# EAGLE schematic pdp8l (EAGLE 6.6.0), part 1 of 2

## Sheet 1 of 23
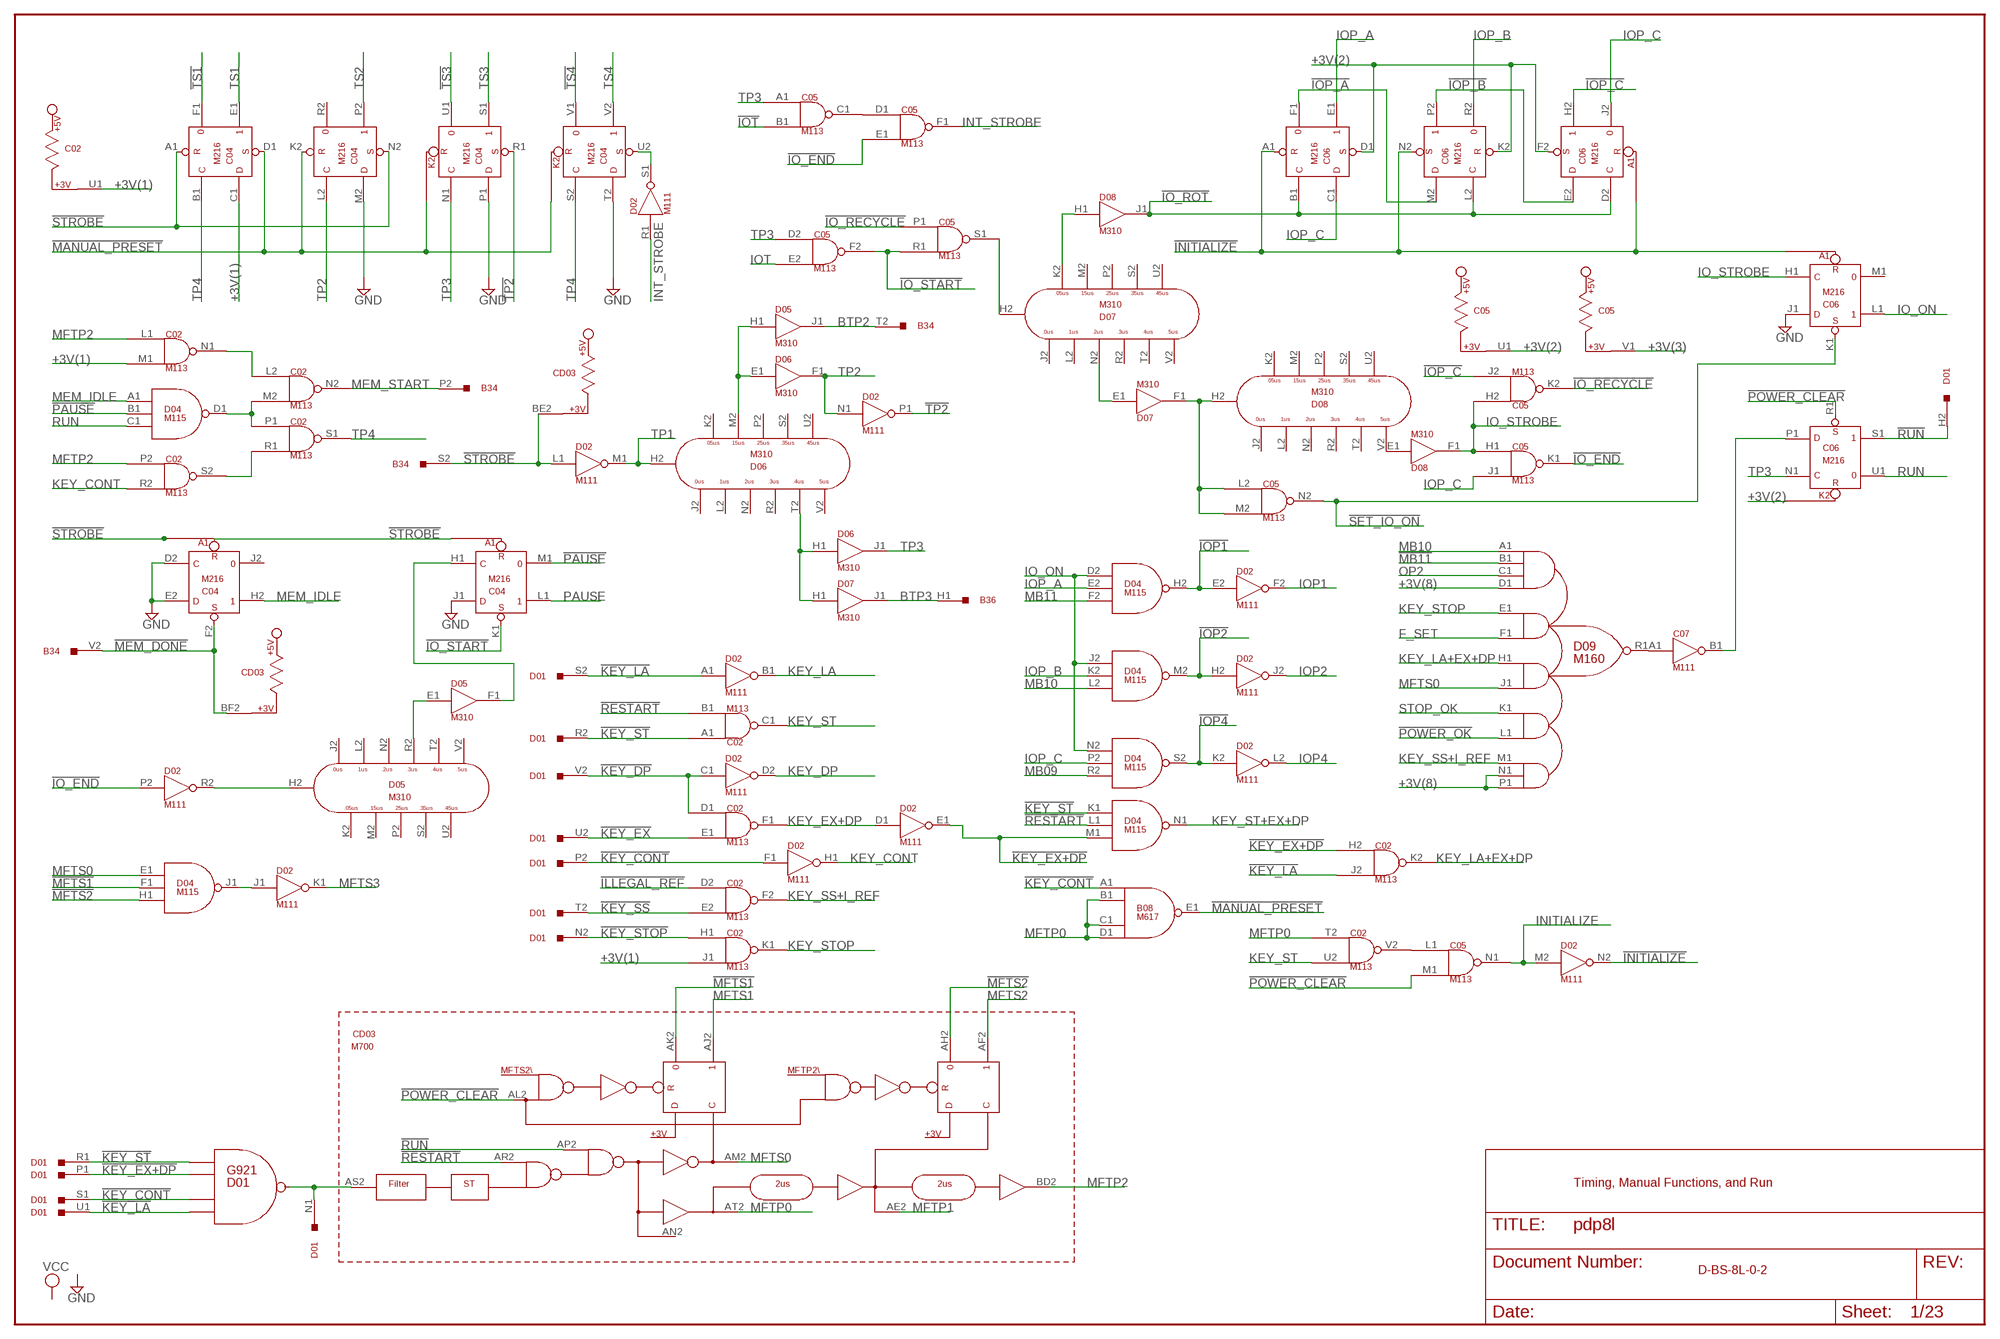
[diagram p0: schematic, sheet 1]

### Parts
B08  M617  [H807]
B34  M903  [H807]
B36  M903  [H807]
C02  M113  [H807]
C04  M216  M206X  [H807]
C05  M113  [H807]
C06  M216  M206X  [H807]
C07  M111  [H807]
CD03  M700  [H807-2]
D01  G921  M916  [H807]
D02  M111  [H807]
D04  M115  [H807]
D05  M310  [H807]
D06  M310  [H807]
D07  M310  [H807]
D08  M310  [H807]
D09  M160  [H807]

### Nets
!ILLEGAL_REF: C02.D2(F2:IN1) ; also sheet 2,5
!INITIALIZE: C06.A1(E1:R) C06.N2(P2:S) D02.N2(N2:OUT) ; also sheet 12,21,22
!INT_STROBE: C04.U2(V2:S) D02.S1(S1:OUT)
!IO_END: C05.E1(F1:IN2) C05.K1(K1:OUT) D02.P2(R2:IN)
!IO_RECYCLE: C05.K2(K2:OUT) C05.P1(S1:IN1)
!IO_ROT: C06.B1(E1:C) C06.D2(H2:C) C06.L2(P2:C) D08.J1(J1:OUT)
!IO_START: C04.K1(L1:S) C05.F2(F2:OUT) C05.R1(S1:IN2)
!IOP1: D02.E2(F2:IN) D04.H2(H2:OUT) ; also sheet 3,12
!IOP2: D02.H2(J2:IN) D04.M2(M2:OUT) ; also sheet 3,12
!IOP4: D02.K2(L2:IN) D04.S2(S2:OUT) ; also sheet 3,12
!IOP_A: C06.F1 C06.M2(P2:D)
!IOP_B: C06.E2(H2:D) C06.P2
!IOP_C: C05.J2(K2:IN2) C06.H2
!IOT: C05.B1(C1:IN2) ; also sheet 2
!KEY_CONT: B08.A1(E1:IN1) D01.P2 D01.S1 D02.F1(H1:IN) ; also sheet 5
!KEY_DP: C02.D1(F1:IN1) D01.V2 D02.C1(D2:IN)
!KEY_EX: C02.E1(F1:IN2) D01.U2
!KEY_EX+DP: C02.H2(K2:IN1) D01.P1 D02.E1(E1:OUT) D04.M1(N1:IN3)
!KEY_LA: C02.J2(K2:IN2) D01.S2 D01.U1 D02.A1(B1:IN) ; also sheet 19
!KEY_SS: C02.E2(F2:IN2) D01.T2
!KEY_ST: C02.A1(C1:IN1) D01.R1 D01.R2 D04.K1(N1:IN1)
!KEY_STOP: C02.H1(K1:IN1) D01.N2
!MANUAL_PRESET: B08.E1(E1:OUT) C04.D1(E1:S) C04.K2(P2:R) ; also sheet 2,6
!MB11: D09.B1(R1:IN1B) ; also sheet 2,3,6,7,16,23
!MEM_DONE: B34.V2 C04.F2(H2:S) CD03.BF2 ; also sheet 6,15
!MFTS1: CD03.AK2(CK2) D04.F1(J1:IN2) ; also sheet 3
!MFTS2: CD03.AH2(CH2) D04.H1(J1:IN3) ; also sheet 3
!MFTS3: D02.J1(K1:IN) D04.J1(J1:OUT)
!PAUSE: C04.M1 D04.B1(D1:IN2)
!POWER_CLEAR: C05.M1(N1:IN2) C06.R1(S1:S) CD03.AL2(CL2) ; also sheet 15
!POWER_OK: D09.L1(R1:IN4B) ; also sheet 15
!RESTART: C02.B1(C1:IN2) CD03.AR2(CR2) D04.L1(N1:IN2) ; also sheet 3,19,20
!RUN: C06.S1 CD03.AP2(CP2) D01.H2 ; also sheet 12
!SET_IO_ON: C05.N2(N2:OUT) C06.K1(L1:S) ; also sheet 5
!STROBE: B34.S2 C04.A1(E1:R) C04.N2(P2:S) CD03.BE2 D02.L1(M1:IN) ; also sheet 6,15
!TP2: C04.R1(S1:S) D02.P1(P1:OUT) ; also sheet 5
!TS1: C04.F1 ; also sheet 12
!TS3: C04.U1 ; also sheet 12
!TS4: C04.V1 ; also sheet 3
+3V(1): C02.J1(K1:IN2) C02.M1(N1:IN2) C02.U1 C04.C1(E1:D) ; also sheet 2
+3V(2): C05.U1 C06.D1(E1:S) C06.F2(H2:S) C06.K2(P2:R)
+3V(3): C05.V1 ; also sheet 2
+3V(8): D09.D1(R1:IN1D) D09.N1(R1:IN5B) D09.P1(R1:IN5C) ; also sheet 3
BTP2: B34.T2 D05.J1(J1:OUT)
BTP3: B36.H1 D07.J1(J1:OUT)
C02N1: C02.L2(N2:IN1) C02.N1(N1:OUT)
C02S2: C02.R1(S1:IN2) C02.S2(S2:OUT)
C02V2: C02.V2(V2:OUT) C05.L1(N1:IN1)
C05C1: C05.C1(C1:OUT) C05.D1(F1:IN1)
C05S1: C05.S1(S1:OUT) D07.H2(H2:H2)
C07B1: C06.P1(S1:D) C07.B1(B1:OUT)
D01N1: CD03.AS2(CS2) D01.N1
D04D1: C02.M2(N2:IN2) C02.P1(S1:IN1) D04.D1(D1:OUT)
D05F1: C04.H1(L1:C) D05.F1(F1:OUT)
D05R2: D05.E1(F1:IN) D05.R2(H2:R2)
D06M2: D05.H1(J1:IN) D06.E1(F1:IN) D06.M2(H2:M2)
D06T2: D06.H1(J1:IN) D06.T2(H2:T2) D07.H1(J1:IN)
D07K2: D07.K2(H2:K2) D08.H1(J1:IN)
D07N2: D07.E1(F1:IN) D07.N2(H2:N2)
D08V2: D08.E1(F1:IN) D08.V2(H2:V2)
D09R1: C07.A1(B1:IN) D09.R1(R1:OUT)
F_SET: D09.F1(R1:IN2B) ; also sheet 2,3,6
GND [Supply]: C04.D2(H2:C) C04.E2(H2:D) C04.J1(L1:D) C04.M2(P2:D) C04.P1(S1:D) C04.T2(V2:D) C06.J1(L1:D) ; also sheet 3,8,9,10,11,12,13,14,15,16,19,20,21,23
INITIALIZE: C05.N1(N1:OUT) D02.M2(N2:IN) ; also sheet 12,13,14
INT_STROBE: C05.F1(F1:OUT) D02.R1(S1:IN) ; also sheet 6
IO_END: D02.R2(R2:OUT) D05.H2(H2:H2)
IO_ON: C06.L1 D04.D2(H2:IN1) D04.J2(M2:IN1) D04.N2(S2:IN1)
IO_STROBE: C05.H1(K1:IN1) C05.H2(K2:IN1) C06.H1(L1:C) D08.F1(F1:OUT) ; also sheet 5
IOP1: D02.F2(F2:OUT) ; also sheet 13,14,21,22,23
IOP2: D02.J2(J2:OUT) ; also sheet 13,14,20,21,22
IOP4: D02.L2(L2:OUT) ; also sheet 13,14,21,22,23
IOP_A: C06.E1 D04.E2(H2:IN2)
IOP_B: C06.R2 D04.K2(M2:IN2)
IOP_C: C05.J1(K1:IN2) C06.C1(E1:D) C06.J2 D04.P2(S2:IN2)
IOT: C05.E2(F2:IN2) ; also sheet 2,6
KEY_CONT: C02.R2(S2:IN2) D02.H1(H1:OUT)
KEY_DP: D02.D2(D2:OUT) ; also sheet 3
KEY_EX+DP: C02.F1(F1:OUT) D02.D1(E1:IN) ; also sheet 3,4
KEY_LA: D02.B1(B1:OUT) ; also sheet 3,19
KEY_LA+EX+DP: C02.K2(K2:OUT) D09.H1(R1:IN3A) ; also sheet 5
KEY_SS+I_REF: C02.F2(F2:OUT) D09.M1(R1:IN5A)
KEY_ST: C02.C1(C1:OUT) C02.U2(V2:IN2) ; also sheet 2,3
KEY_ST+EX+DP: D04.N1(N1:OUT) ; also sheet 3
KEY_STOP: C02.K1(K1:OUT) D09.E1(R1:IN2A)
MB09: D04.R2(S2:IN3) ; also sheet 3,4,7,12,23
MB10: D04.L2(M2:IN3) D09.A1(R1:IN1A) ; also sheet 4,7,12,23
MB11: D04.F2(H2:IN3) ; also sheet 4,7,12,23
MEM_IDLE: C04.H2 D04.A1(D1:IN1)
MEM_START: B34.P2 C02.N2(N2:OUT) ; also sheet 15
MFTP0: B08.B1(E1:IN2) B08.C1(E1:IN3) B08.D1(E1:IN4) C02.T2(V2:IN1) CD03.AT2(CT2) ; also sheet 19
MFTP1: CD03.AE2(CE2) ; also sheet 5,19
MFTP2: C02.L1(N1:IN1) C02.P2(S2:IN1) CD03.BD2(DD2) ; also sheet 2,5
MFTS0: CD03.AM2(CM2) D04.E1(J1:IN1) D09.J1(R1:IN3B)
MFTS1: CD03.AJ2(CJ2) ; also sheet 3
MFTS2: CD03.AF2(CF2) ; also sheet 3,4
MFTS3: D02.K1(K1:OUT) ; also sheet 3
OP2: D09.C1(R1:IN1C) ; also sheet 2,3,5
PAUSE: C04.L1 ; also sheet 3
RUN: C06.U1 D04.C1(D1:IN3)
SET_IO_ON: C05.L2(N2:IN1) C05.M2(N2:IN2) D07.F1(F1:OUT) D08.H2(H2:H2)
STOP_OK: D09.K1(R1:IN4A) ; also sheet 15,20
TP1: D02.M1(M1:OUT) D06.H2(H2:H2) ; also sheet 2,5,6
TP2: C04.L2(P2:C) D02.N1(P1:IN) D06.F1(F1:OUT) ; also sheet 2,5,6
TP3: C04.N1(S1:C) C05.A1(C1:IN1) C05.D2(F2:IN1) C06.N1(S1:C) D06.J1(J1:OUT) ; also sheet 5,23
TP4: C02.S1(S1:OUT) C04.B1(E1:C) C04.S2(V2:C) ; also sheet 2,5,6
TS1: C04.E1 ; also sheet 3,4
TS2: C04.P2 ; also sheet 2,3,4,5
TS3: C04.S1 ; also sheet 2,3,4
TS4: C04.V2 ; also sheet 3,19
Unconnected: B34.M2 B36.K2 B36.M2 B36.P2 C02.V1 C04.J2 C04.R2 C06.M1 CD03.AN2(CN2) D01.A1 D01.B1 D01.B2 D01.K1 D01.L1 D01.M1 D05.J2(H2:J2) D05.K2(H2:K2) D05.L2(H2:L2) D05.M2(H2:M2) D05.N2(H2:N2) D05.P2(H2:P2) D05.S2(H2:S2) D05.T2(H2:T2) D05.U2(H2:U2) D05.V2(H2:V2) D06.J2(H2:J2) D06.K2(H2:K2) D06.L2(H2:L2) D06.N2(H2:N2) D06.P2(H2:P2) D06.R2(H2:R2) D06.S2(H2:S2) D06.U2(H2:U2) D06.V2(H2:V2) D07.J2(H2:J2) D07.L2(H2:L2) D07.M2(H2:M2) D07.P2(H2:P2) D07.R2(H2:R2) D07.S2(H2:S2) D07.T2(H2:T2) D07.U2(H2:U2) D07.V2(H2:V2) D08.J2(H2:J2) D08.K2(H2:K2) D08.L2(H2:L2) D08.M2(H2:M2) D08.N2(H2:N2) D08.P2(H2:P2) D08.R2(H2:R2) D08.S2(H2:S2) D08.T2(H2:T2) D08.U2(H2:U2)

### Notes on the sheet
- G921
- D01 | Timing, Manual Functions, and Run
- D-BS-8L-0-2

## Sheet 2 of 23
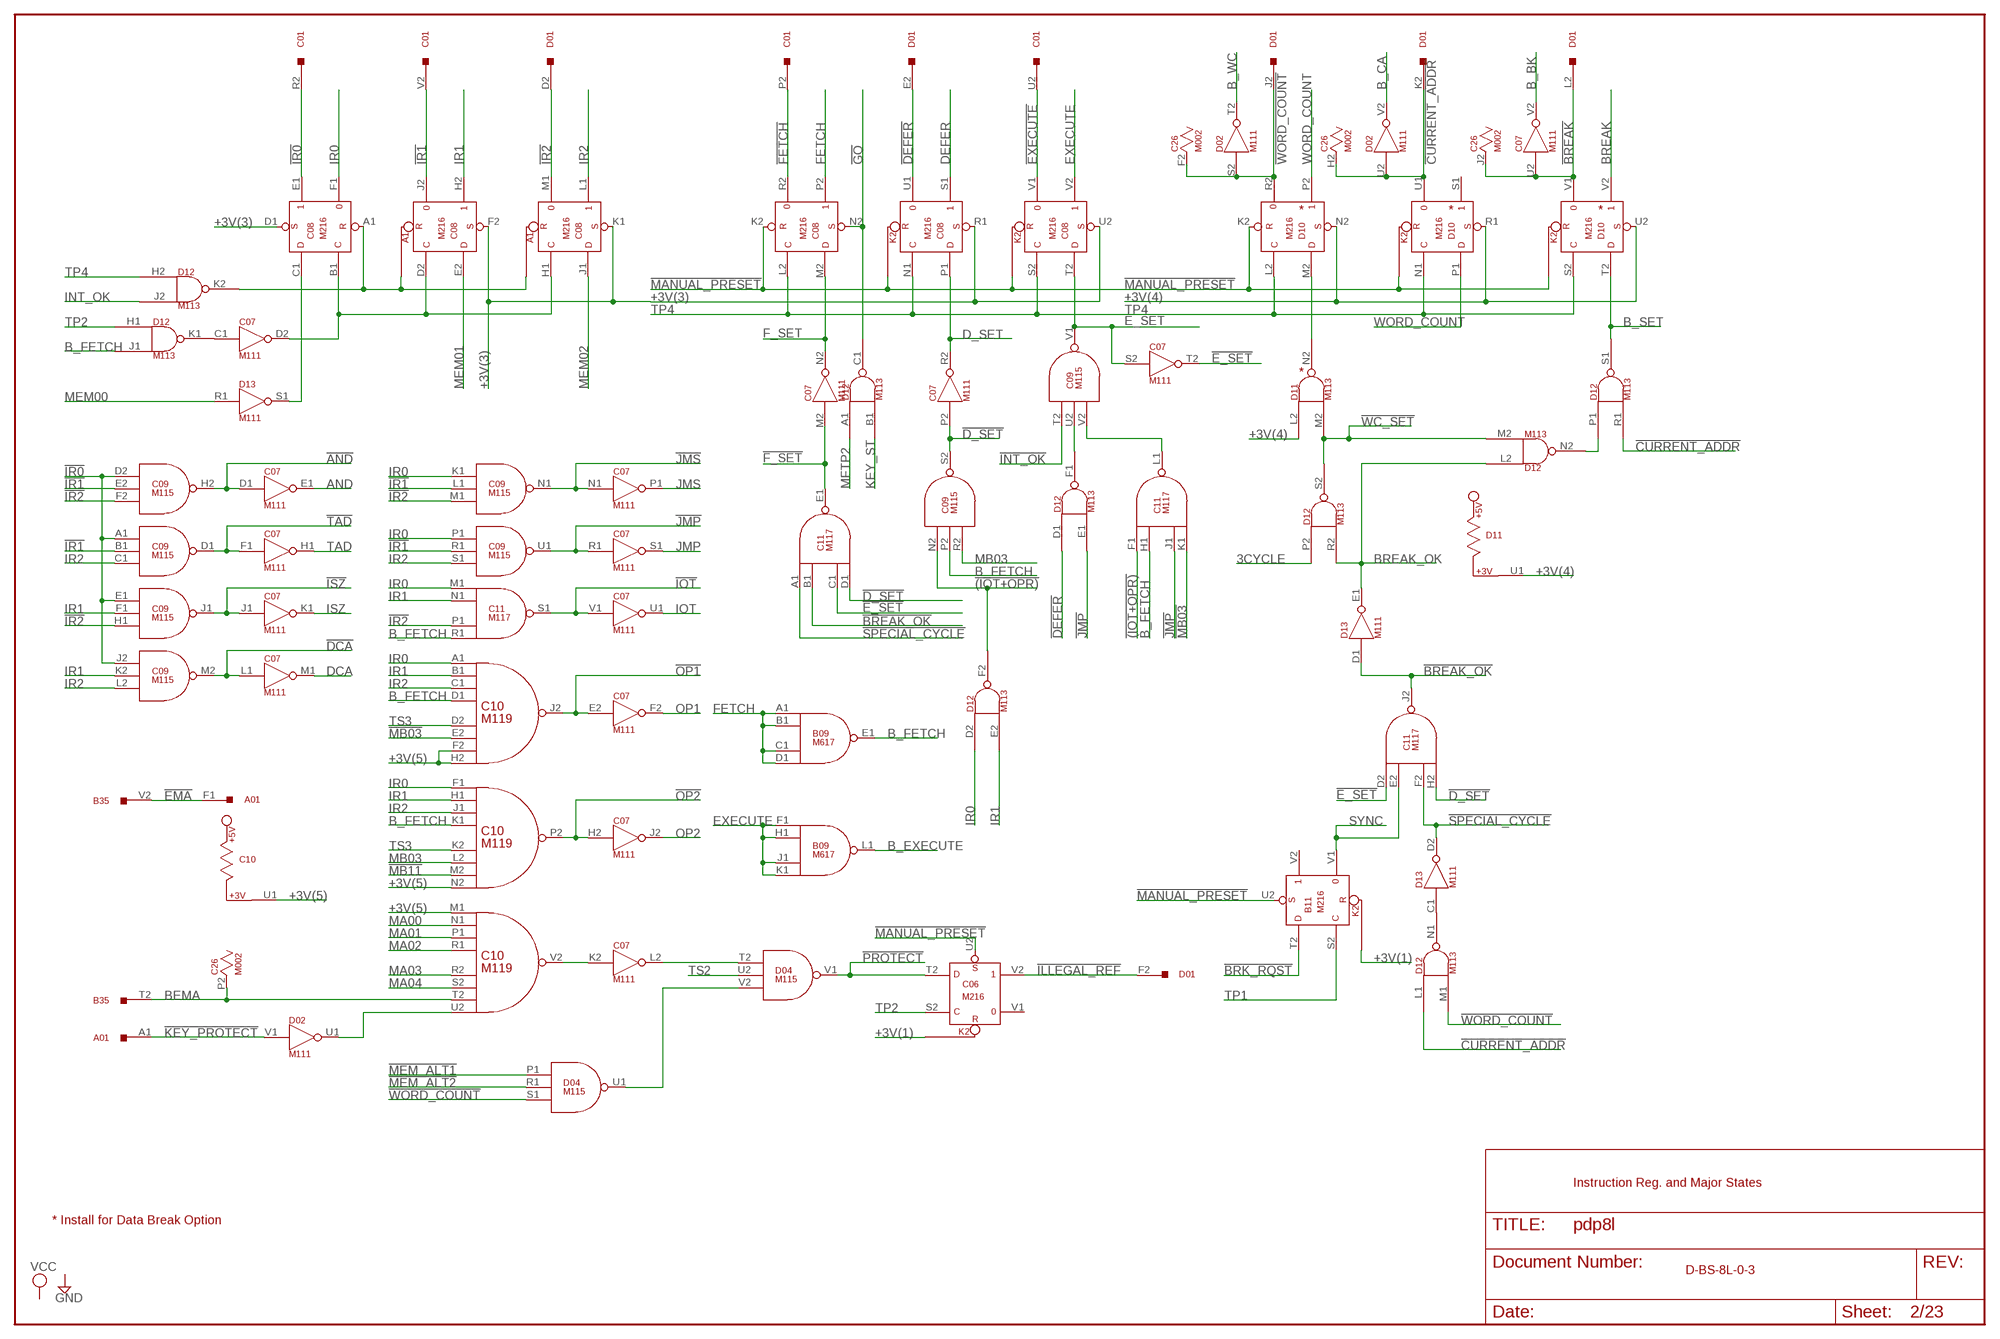
[diagram p1: schematic, sheet 2]

### Parts
A01  G921  M916  [H807]
B09  M617  [H807]
B11  M216  M206X  [H807]
B35  M903  [H807]
C01  G921  M916  [H807]
C08  M216  M206X  [H807]
C09  M115  [H807]
C10  M119  [H807]
C11  M117  [H807]
C26  M002  [H807]
D10  M216  M206X  [H807]
D11  M113  [H807]
D12  M113  [H807]
D13  M111  [H807]

### Nets
3CYCLE: D12.P2(S2:IN1) ; also sheet 12
!(IOT+OPR): C09.N2(S2:IN1) C11.F1(L1:IN1) D12.F2(F2:OUT)
!AND: C07.D1(E1:IN) C09.H2(H2:OUT) ; also sheet 5
!BREAK: C07.U2(V2:IN) C26.J2 D01.L2 D10.V1 ; also sheet 12
!BREAK_OK: C11.B1(E1:IN2) C11.J2(J2:OUT) D13.D1(E1:IN) ; also sheet 6
!BRK_RQST: B11.T2(V2:D) ; also sheet 12
!CURRENT_ADDR: C26.H2 D01.K2 D02.U2(V2:IN) D10.U1 D12.L1(N1:IN1) D12.R1(S1:IN2)
!D_SET: C07.P2(R2:IN) C09.S2(S2:OUT) C11.D1(E1:IN4) C11.H2(J2:IN4) ; also sheet 3
!DCA: C07.L1(M1:IN) C09.M2(M2:OUT) ; also sheet 5
!DEFER: C08.U1 D01.E2 D12.D1(F1:IN1)
!E_SET: C07.T2(T2:OUT) C11.C1(E1:IN3) C11.D2(J2:IN1) ; also sheet 3,19
!EMA: A01.F1 B35.V2
!EXECUTE: C01.U2 C08.V1
!F_SET: C07.M2(N2:IN) C11.E1(E1:OUT) ; also sheet 19
!FETCH: C01.P2 C08.R2
!GO: C08.N2(P2:S) D12.C1(C1:OUT) ; also sheet 5,6
!ILLEGAL_REF: C06.V2 D01.F2 ; also sheet 1,5
!INT_OK: C09.T2(V1:IN1) ; also sheet 3,6
!IOT: C07.V1(U1:IN) C11.S1(S1:OUT) ; also sheet 1
!IR0: C01.R2 C08.E1 C09.A1(D1:IN1) C09.D2(H2:IN1) C09.E1(J1:IN1) C09.J2(M2:IN1) ; also sheet 19
!IR1: C01.V2 C08.J2 C09.B1(D1:IN2) C09.E2(H2:IN2) C09.L1(N1:IN2) C09.R1(U1:IN2)
!IR2: C08.M1 C09.F2(H2:IN3) C09.H1(J1:IN3) C09.M1(N1:IN3) C11.P1(S1:IN3) D01.D2
!ISZ: C07.J1(K1:IN) C09.J1(J1:OUT)
!JMP: C07.R1(S1:IN) C09.U1(U1:OUT) C11.J1(L1:IN3) D12.E1(F1:IN2) ; also sheet 3,19
!JMS: C07.N1(P1:IN) C09.N1(N1:OUT) ; also sheet 19
!KEY_PROTECT: A01.A1 D02.V1(U1:IN)
!MANUAL_PRESET: B11.U2(V2:S) C06.U2(V2:S) C08.K2(P2:R) D10.K2(P2:R) ; also sheet 1,6
!MB03: C10.E2(J2:IN6) C11.K1(L1:IN4) ; also sheet 3,6,7,12,13,14,16,20,21,22,23
!MB11: C10.M2(P2:IN7) ; also sheet 1,3,6,7,16,23
!MEM_ALT1: D04.P1(U1:IN1) ; also sheet 3
!MEM_ALT2: D04.R1(U1:IN2) ; also sheet 4
!OP1: C07.E2(F2:IN) C10.J2(J2:OUT) ; also sheet 5
!OP2: C07.H2(J2:IN) C10.P2(P2:OUT) ; also sheet 5
!PROTECT: C06.T2(V2:D) D04.V1(V1:OUT) ; also sheet 3,4
!SPECIAL_CYCLE: C11.A1(E1:IN1) C11.F2(J2:IN3) D13.D2(D2:OUT)
!TAD: C07.F1(H1:IN) C09.D1(D1:OUT) ; also sheet 5
!WC_SET: D11.M2(N2:IN2) D12.M2(N2:IN2) D12.S2(S2:OUT) ; also sheet 19
!WORD_COUNT: C26.F2 D01.J2 D02.S2(T2:IN) D04.S1(U1:IN3) D10.R2 D12.M1(N1:IN2) ; also sheet 4,6,19
+3V(3): C08.D1(E1:S) C08.F2(H2:S) C08.K1(L1:S) C08.R1(S1:S) C08.U2(V2:S) ; also sheet 1
+3V(4): D10.N2(P2:S) D10.R1(S1:S) D10.U2(V2:S) D11.L2(N2:IN1) D11.U1 ; also sheet 6
+3V(5): C10.F2(J2:IN7) C10.H2(J2:IN8) C10.M1(V2:IN1) C10.N2(P2:IN8) C10.U1
AND: C07.E1(E1:OUT) ; also sheet 4
B_BK: C07.V2(V2:OUT) ; also sheet 3,4
B_CA: D02.V2(V2:OUT) ; also sheet 3,4
B_EXECUTE: B09.L1(L1:OUT) ; also sheet 3,4,5
B_FETCH: B09.E1(E1:OUT) C09.P2(S2:IN2) C10.D1(J2:IN4) C10.K1(P2:IN4) C11.H1(L1:IN2) C11.R1(S1:IN4) D12.J1(K1:IN2) ; also sheet 3,5,6
B_SET: D10.T2(V2:D) D12.S1(S1:OUT) ; also sheet 19
B_WC: D02.T2(T2:OUT) ; also sheet 3
BEMA: B35.T2 C10.T2(V2:IN7) C26.P2
BREAK: D10.V2 ; also sheet 6
BREAK_OK: D12.L2(N2:IN1) D12.R2(S2:IN2) D13.E1(E1:OUT) ; also sheet 3
C07D2: C07.D2(D2:OUT) C08.B1(E1:C) C08.D2(H2:C) C08.H1(L1:C)
C07L2: C07.L2(L2:OUT) D04.T2(V1:IN1)
C10V2: C07.K2(L2:IN) C10.V2(V2:OUT)
C11L1: C09.V2(V1:IN3) C11.L1(L1:OUT)
D04U1: D04.U1(U1:OUT) D04.V2(V1:IN3)
D11N2: D10.M2(P2:D) D11.N2(N2:OUT)
D12F1: C09.U2(V1:IN2) D12.F1(F1:OUT)
D12K1: C07.C1(D2:IN) D12.K1(K1:OUT)
D12K2: C08.A1(E1:R) D12.K2(K2:OUT)
D12N2: D12.N2(N2:OUT) D12.P1(S1:IN1)
D13S1: C08.C1(E1:D) D13.S1(S1:OUT)
D_SET: C07.R2(R2:OUT) C08.P1(S1:D)
DCA: C07.M1(M1:OUT) ; also sheet 3
DEFER: C08.S1 ; also sheet 3,4,5,19
E_SET: C07.S2(T2:IN) C08.T2(V2:D) C09.V1(V1:OUT)
EXECUTE: B09.F1(L1:IN1) B09.H1(L1:IN2) B09.J1(L1:IN3) B09.K1(L1:IN4) C08.V2
F_SET: C07.N2(N2:OUT) C08.M2(P2:D) ; also sheet 1,3,6
FETCH: B09.A1(E1:IN1) B09.B1(E1:IN2) B09.C1(E1:IN3) B09.D1(E1:IN4) C08.P2 ; also sheet 4
INT_OK: D12.J2(K2:IN2) ; also sheet 6,19
IOT: C07.U1(U1:OUT) ; also sheet 1,6
IR0: C08.F1 C09.K1(N1:IN1) C09.P1(U1:IN1) C10.A1(J2:IN1) C10.F1(P2:IN1) C11.M1(S1:IN1) D12.D2(F2:IN1)
IR1: C08.H2 C09.F1(J1:IN2) C09.K2(M2:IN2) C10.B1(J2:IN2) C10.H1(P2:IN2) C11.N1(S1:IN2) D12.E2(F2:IN2)
IR2: C08.L1 C09.C1(D1:IN3) C09.L2(M2:IN3) C09.S1(U1:IN3) C10.C1(J2:IN3) C10.J1(P2:IN3)
ISZ: C07.K1(K1:OUT) ; also sheet 4,5
JMP: C07.S1(S1:OUT) ; also sheet 3,5
JMS: C07.P1(P1:OUT) ; also sheet 3,4,5
KEY_PROTECT: C10.U2(V2:IN8) D02.U1(U1:OUT)
KEY_ST: D12.B1(C1:IN2) ; also sheet 1,3
MA00: C10.N1(V2:IN2) ; also sheet 7,17
MA01: C10.P1(V2:IN3) ; also sheet 7,17
MA02: C10.R1(V2:IN4) ; also sheet 7,17
MA03: C10.R2(V2:IN5) ; also sheet 7,17
MA04: C10.S2(V2:IN6) ; also sheet 7,17
MB03: C09.R2(S2:IN3) C10.L2(P2:IN6) ; also sheet 7,12,23
MEM00: D13.R1(S1:IN) ; also sheet 8,16,23
MEM01: C08.E2(H2:D) ; also sheet 8,16,23
MEM02: C08.J1(L1:D) ; also sheet 8,16,23
MFTP2: D12.A1(C1:IN1) ; also sheet 1,5
OP1: C07.F2(F2:OUT) ; also sheet 3,4
OP2: C07.J2(J2:OUT) ; also sheet 1,3,5
SPECIAL_CYCLE: D12.N1(N1:OUT) D13.C1(D2:IN)
SYNC: B11.V1 C11.E2(J2:IN2)
TAD: C07.H1(H1:OUT) ; also sheet 3
TP1: B11.S2(V2:C) ; also sheet 1,5,6
TP2: C06.S2(V2:C) D12.H1(K1:IN1) ; also sheet 1,5,6
TP4: C08.L2(P2:C) C08.N1(S1:C) C08.S2(V2:C) D10.L2(P2:C) D10.N1(S1:C) D10.S2(V2:C) D12.H2(K2:IN1) ; also sheet 1,5,6
TS2: D04.U2(V1:IN2) ; also sheet 1,3,4,5
TS3: C10.D2(J2:IN5) C10.K2(P2:IN5) ; also sheet 1,3,4
WORD_COUNT: D10.P1(S1:D) D10.P2
Unconnected: A01.M1 A01.N1 A01.P1 A01.R1 A01.S1 A01.U1 A01.V2 B11.V2 B35.M2 B35.P2 B35.S2 C01.A1 C01.B1 C01.B2 C01.C1 C01.D2 C01.L1 C01.M1 C01.N1 C01.P1 C01.R1 C01.S1 C01.T2 C01.U1 C06.V1 C10.V1 C11.U1 C11.V1 C26.K2 C26.L2 C26.M2 C26.N2 D10.H1(L1:C) D10.J1(L1:D) D10.K1(L1:S) D10.L1 D10.M1 D10.S1 D12.U1 D12.V1

### Notes on the sheet
- * | * | *
- *
- Instruction Reg. and Major States
- * Install for Data Break Option
- D-BS-8L-0-3

## Sheet 3 of 23
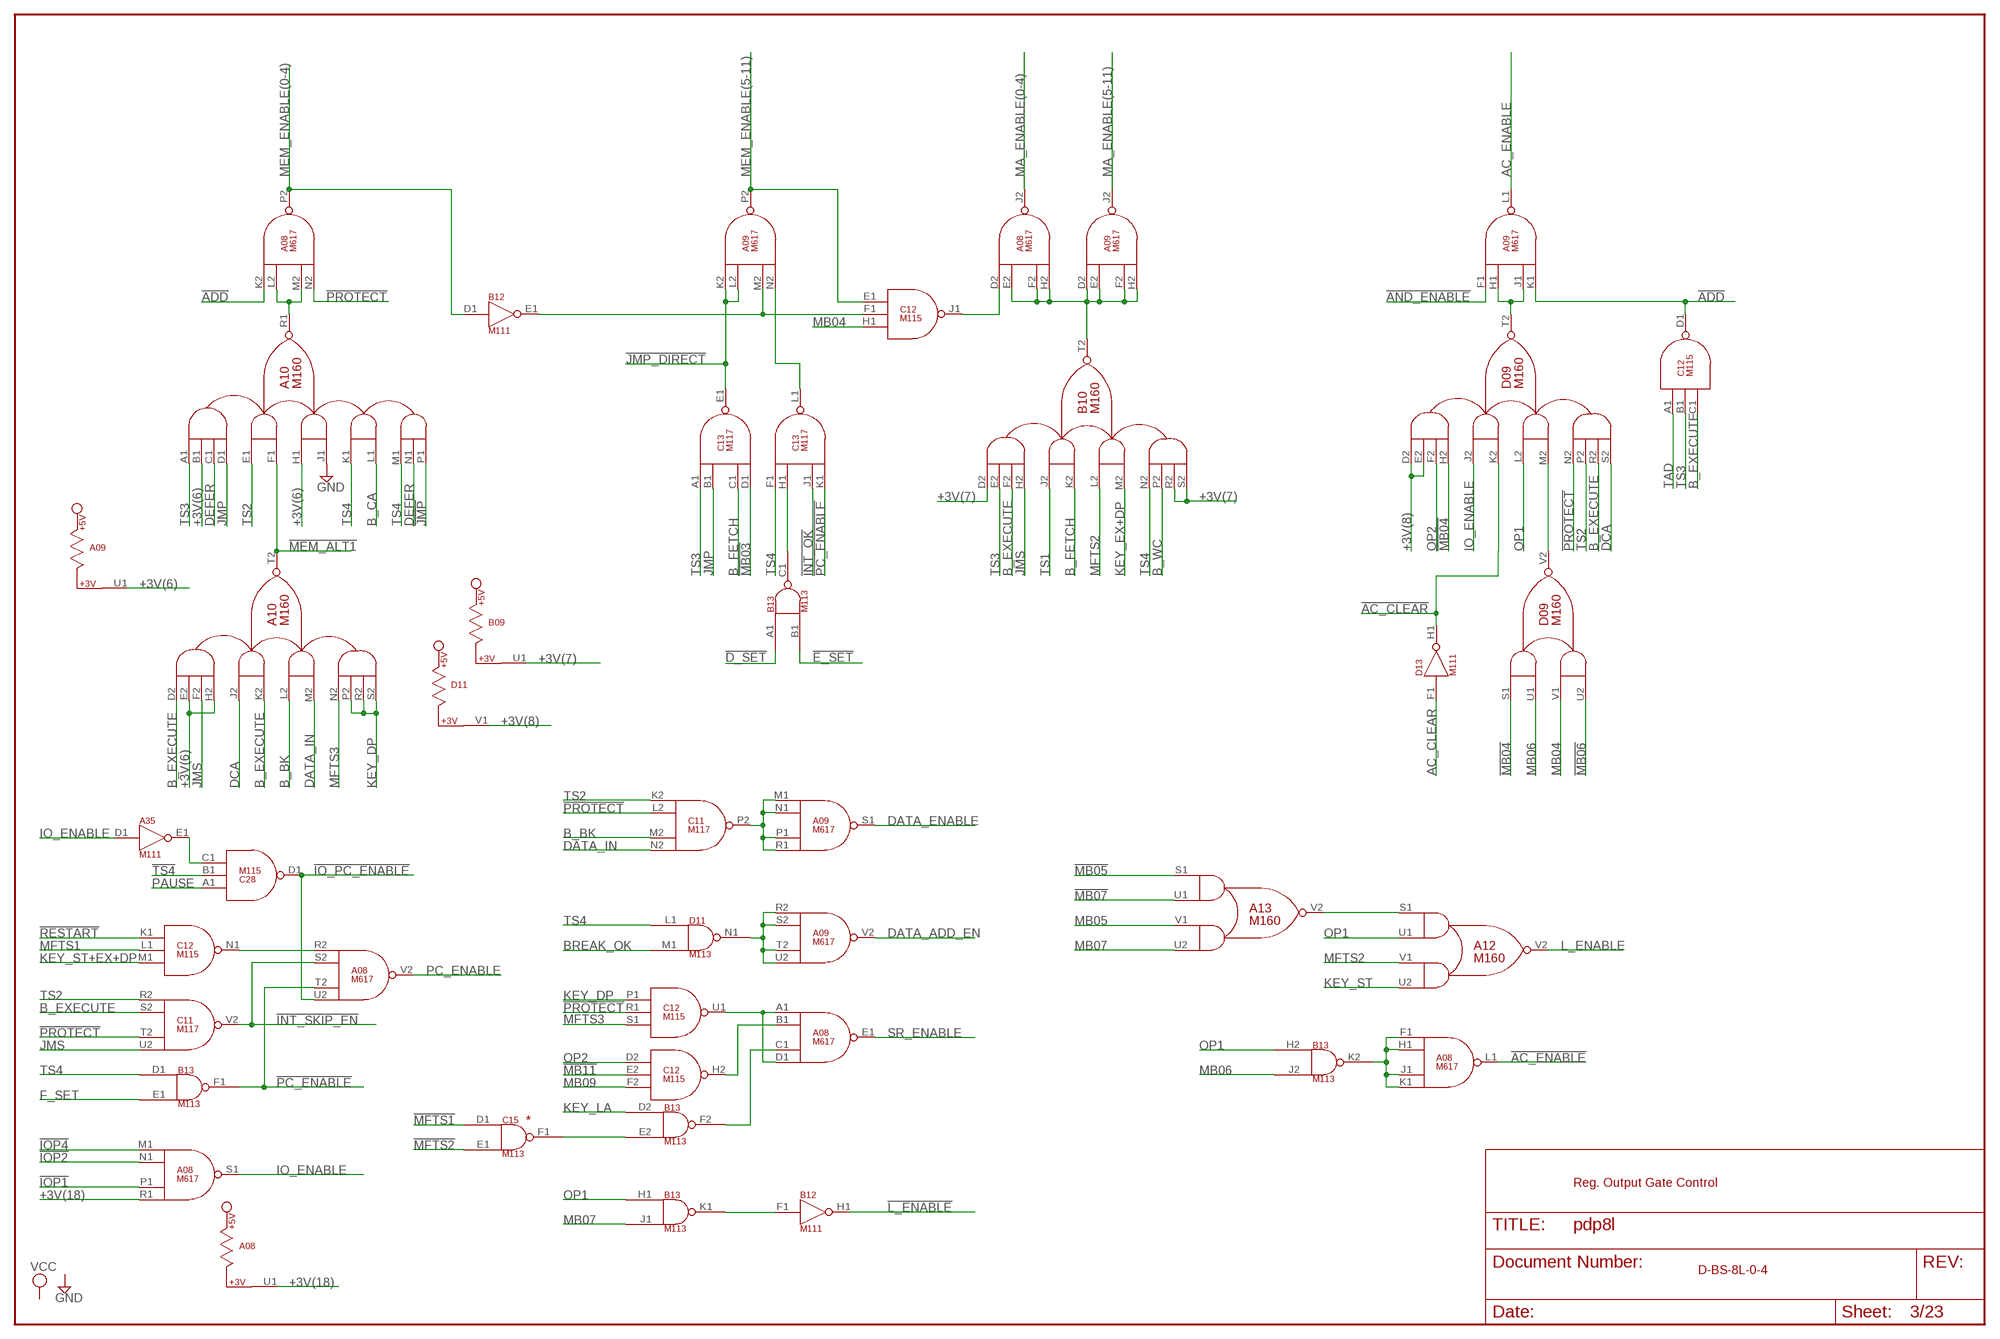
[diagram p2: schematic, sheet 3]

### Parts
A08  M617  [H807]
A09  M617  [H807]
A10  M160  [H807]
A12  M160  [H807]
A13  M160  [H807]
A35  M111  [H807]
B10  M160  [H807]
B12  M111  [H807]
B13  M113  [H807]
C12  M115  [H807]
C13  M117  [H807]
C15  M113  [H807]
C28  M115  [H807]

### Nets
!!AC_ENABLE: A08.F1(L1:IN1) A08.H1(L1:IN2) A08.J1(L1:IN3) A08.K1(L1:IN4) B13.K2(K2:OUT)
!!L_ENABLE: B12.F1(H1:IN) B13.K1(K1:OUT)
!AC_CLEAR: D09.K2(T2:IN2B) D13.H1(H1:OUT)
!AC_ENABLE: A08.L1(L1:OUT) ; also sheet 8,9,10,11
!ADD: A08.K2(P2:IN1) A09.K1(L1:IN4) C12.D1(D1:OUT)
!AND_ENABLE: A09.F1(L1:IN1) ; also sheet 4
!D_SET: B13.A1(C1:IN1) ; also sheet 2
!DATA_ADD_EN: A09.R2(V2:IN1) A09.S2(V2:IN2) A09.T2(V2:IN3) A09.U2(V2:IN4) D11.N1(N1:OUT)
!DATA_ENABLE: A09.M1(S1:IN1) A09.N1(S1:IN2) A09.P1(S1:IN3) A09.R1(S1:IN4) C11.P2(P2:OUT)
!E_SET: B13.B1(C1:IN2) ; also sheet 2,19
!INT_OK: C13.J1(L1:IN3) ; also sheet 2,6
!INT_SKIP_EN: A08.S2(V2:IN2) C11.V2(V2:OUT) ; also sheet 4
!IO_ENABLE: A35.E1(E1:OUT) C28.C1(D1:IN3)
!IO_PC_ENABLE: A08.U2(V2:IN4) C28.D1(D1:OUT) ; also sheet 4
!IOP1: A08.P1(S1:IN3) ; also sheet 1,12
!IOP2: A08.N1(S1:IN2) ; also sheet 1,12
!IOP4: A08.M1(S1:IN1) ; also sheet 1,12
!JMP: A10.P1(R1:IN5C) ; also sheet 2,19
!JMP_DIRECT: A09.K2(P2:IN1) A09.L2(P2:IN2) C13.E1(E1:OUT) ; also sheet 5
!L_ENABLE: B12.H1(H1:OUT) ; also sheet 7
!MA_ENABLE(5-11): A08.E2(J2:IN2) A08.F2(J2:IN3) A08.H2(J2:IN4) A09.D2(J2:IN1) A09.E2(J2:IN2) A09.F2(J2:IN3) A09.H2(J2:IN4) B10.T2(T2:OUT)
!MB03: C13.D1(E1:IN4) ; also sheet 2,6,7,12,13,14,16,20,21,22,23
!MB04: D09.H2(T2:IN1D) D09.S1(V2:IN1A) ; also sheet 6,7,12,13,14,16,20,21,22,23
!MB05: A13.S1(V2:IN1A) ; also sheet 6,7,12,13,14,16,21,22,23
!MB06: D09.U2(V2:IN2B) ; also sheet 6,7,12,13,16,20,21,22,23
!MB07: A13.U1(V2:IN1B) ; also sheet 6,7,12,14,16,20,22,23
!MB11: C12.E2(H2:IN2) ; also sheet 1,2,6,7,16,23
!MEM_ALT1: A10.F1(R1:IN2B) A10.T2(T2:OUT) ; also sheet 2
!MEM_ENABLE(0-4): A09.M2(P2:IN3) B12.E1(E1:OUT) C12.F1(J1:IN2)
!MFTS1: C15.D1(F1:IN1) ; also sheet 1
!MFTS2: C15.E1(F1:IN2) ; also sheet 1
!PC_ENABLE: A08.T2(V2:IN3) B13.F1(F1:OUT) C13.K1(L1:IN4) ; also sheet 4
!PROTECT: A08.N2(P2:IN4) C11.L2(P2:IN2) C11.T2(V2:IN3) C12.R1(U1:IN2) D09.N2(T2:IN4A) ; also sheet 2,4
!RESTART: C12.K1(N1:IN1) ; also sheet 1,19,20
!TS4: C28.B1(D1:IN2) ; also sheet 1
+3V(6): A09.U1 A10.B1(R1:IN1B) A10.E2(T2:IN1B) A10.H1(R1:IN3A) A10.H2(T2:IN1D)
+3V(7): B09.U1 B10.D2(T2:IN1A) B10.R2(T2:IN4C) B10.S2(T2:IN4D)
+3V(8): D09.D2(T2:IN1A) D09.E2(T2:IN1B) D11.V1 ; also sheet 1
+3V(18): A08.R1(S1:IN4) A08.U1
A10R1: A08.L2(P2:IN2) A08.M2(P2:IN3) A10.R1(R1:OUT)
A13V2: A12.S1(V2:IN1A) A13.V2(V2:OUT)
AC_CLEAR: D13.F1(H1:IN) ; also sheet 12
AC_ENABLE: A09.L1(L1:OUT) ; also sheet 8,9,10,11
B13C1: B13.C1(C1:OUT) C13.H1(L1:IN2)
B13F2: A08.C1(E1:IN3) B13.F2(F2:OUT)
B_BK: A10.L2(T2:IN3A) C11.M2(P2:IN3) ; also sheet 2,4
B_CA: A10.L1(R1:IN4B) ; also sheet 2,4
B_EXECUTE: A10.D2(T2:IN1A) A10.K2(T2:IN2B) B10.F2(T2:IN1C) C11.S2(V2:IN2) C12.C1(D1:IN3) D09.R2(T2:IN4C) ; also sheet 2,4,5
B_FETCH: B10.K2(T2:IN2B) C13.C1(E1:IN3) ; also sheet 2,5,6
B_WC: B10.P2(T2:IN4B) ; also sheet 2
BREAK_OK: D11.M1(N1:IN2) ; also sheet 2
C12H2: A08.B1(E1:IN2) C12.H2(H2:OUT)
C12J1: A08.D2(J2:IN1) C12.J1(J1:OUT)
C12N1: A08.R2(V2:IN1) C12.N1(N1:OUT)
C12U1: A08.A1(E1:IN1) A08.D1(E1:IN4) C12.U1(U1:OUT)
C13L1: A09.N2(P2:IN4) C13.L1(L1:OUT)
C15F1: B13.E2(F2:IN2) C15.F1(F1:OUT)
D09T2: A09.H1(L1:IN2) A09.J1(L1:IN3) D09.T2(T2:OUT)
D09V2: D09.M2(T2:IN3B) D09.V2(V2:OUT)
DATA_ADD_EN: A09.V2(V2:OUT) ; also sheet 8,9,10,11
DATA_ENABLE: A09.S1(S1:OUT) ; also sheet 8,9,10,11
DATA_IN: A10.M2(T2:IN3B) C11.N2(P2:IN4) ; also sheet 12
DCA: A10.J2(T2:IN2A) D09.S2(T2:IN4D) ; also sheet 2
DEFER: A10.C1(R1:IN1C) A10.N1(R1:IN5B) ; also sheet 2,4,5,19
F_SET: B13.E1(F1:IN2) ; also sheet 1,2,6
GND [Supply]: A10.J1(R1:IN3B) ; also sheet 1,8,9,10,11,12,13,14,15,16,19,20,21,23
IO_ENABLE: A08.S1(S1:OUT) A35.D1(E1:IN) D09.J2(T2:IN2A) ; also sheet 5,8,9,10,11
JMP: A10.D1(R1:IN1D) C13.B1(E1:IN2) ; also sheet 2,5
JMS: A10.F2(T2:IN1C) B10.H2(T2:IN1D) C11.U2(V2:IN4) ; also sheet 2,4,5
KEY_DP: A10.P2(T2:IN4B) A10.R2(T2:IN4C) A10.S2(T2:IN4D) C12.P1(U1:IN1) ; also sheet 1
KEY_EX+DP: B10.M2(T2:IN3B) ; also sheet 1,4
KEY_LA: B13.D2(F2:IN1) ; also sheet 1,19
KEY_ST: A12.U2(V2:IN2B) ; also sheet 1,2
KEY_ST+EX+DP: C12.M1(N1:IN3) ; also sheet 1
L_ENABLE: A12.V2(V2:OUT) ; also sheet 7
MA_ENABLE(0-4): A08.J2(J2:OUT) ; also sheet 8,9
MA_ENABLE(5-11): A09.J2(J2:OUT) ; also sheet 9,10,11
MB04: C12.H1(J1:IN3) D09.V1(V2:IN2A) ; also sheet 7,12,23
MB05: A13.V1(V2:IN2A) ; also sheet 5,7,12,20,23
MB06: B13.J2(K2:IN2) D09.U1(V2:IN1B) ; also sheet 5,7,12,14,23
MB07: A13.U2(V2:IN2B) B13.J1(K1:IN2) ; also sheet 5,7,12,13,21,23
MB09: C12.F2(H2:IN3) ; also sheet 1,4,7,12,23
MEM_ENABLE(0-4): A08.P2(P2:OUT) B12.D1(E1:IN) ; also sheet 4,8,9
MEM_ENABLE(5-11): A09.P2(P2:OUT) C12.E1(J1:IN1) ; also sheet 9,10,11
MFTS1: C12.L1(N1:IN2) ; also sheet 1
MFTS2: A12.V1(V2:IN2A) B10.L2(T2:IN3A) ; also sheet 1,4
MFTS3: A10.N2(T2:IN4A) C12.S1(U1:IN3) ; also sheet 1
OP1: A12.U1(V2:IN1B) B13.H1(K1:IN1) B13.H2(K2:IN1) D09.L2(T2:IN3A) ; also sheet 2,4
OP2: C12.D2(H2:IN1) D09.F2(T2:IN1C) ; also sheet 1,2,5
PAUSE: C28.A1(D1:IN1) ; also sheet 1
PC_ENABLE: A08.V2(V2:OUT) ; also sheet 8,9,10,11
SR_ENABLE: A08.E1(E1:OUT) ; also sheet 8,9,10,11
TAD: C12.A1(D1:IN1) ; also sheet 2
TS1: B10.J2(T2:IN2A) ; also sheet 1,4
TS2: A10.E1(R1:IN2A) C11.K2(P2:IN1) C11.R2(V2:IN1) D09.P2(T2:IN4B) ; also sheet 1,2,4,5
TS3: A10.A1(R1:IN1A) B10.E2(T2:IN1B) C12.B1(D1:IN2) C13.A1(E1:IN1) ; also sheet 1,2,4
TS4: A10.K1(R1:IN4A) A10.M1(R1:IN5A) B10.N2(T2:IN4A) B13.D1(F1:IN1) C13.F1(L1:IN1) D11.L1(N1:IN1) ; also sheet 1,19
Unconnected: A08.V1 A35.F1(H1:IN) A35.H1(H1:OUT) B13.P1(S1:IN1) B13.R1(S1:IN2) B13.S1(S1:OUT) B13.U1 B13.V1 C13.U1 C13.V1 C15.U1 C15.V1 C28.E1(J1:IN1) C28.F1(J1:IN2) C28.H1(J1:IN3) C28.J1(J1:OUT) C28.J2(M2:IN1) C28.K1(N1:IN1) C28.K2(M2:IN2) C28.L1(N1:IN2) C28.L2(M2:IN3) C28.M1(N1:IN3) C28.M2(M2:OUT) C28.N1(N1:OUT) C28.N2(S2:IN1) C28.P1(U1:IN1) C28.P2(S2:IN2) C28.R1(U1:IN2) C28.R2(S2:IN3) C28.S1(U1:IN3) C28.S2(S2:OUT) C28.T2(V1:IN1) C28.U1(U1:OUT) C28.U2(V1:IN2) C28.V1(V1:OUT) C28.V2(V1:IN3)

### Notes on the sheet
- *
- Reg. Output Gate Control
- D-BS-8L-0-4

## Sheet 4 of 23
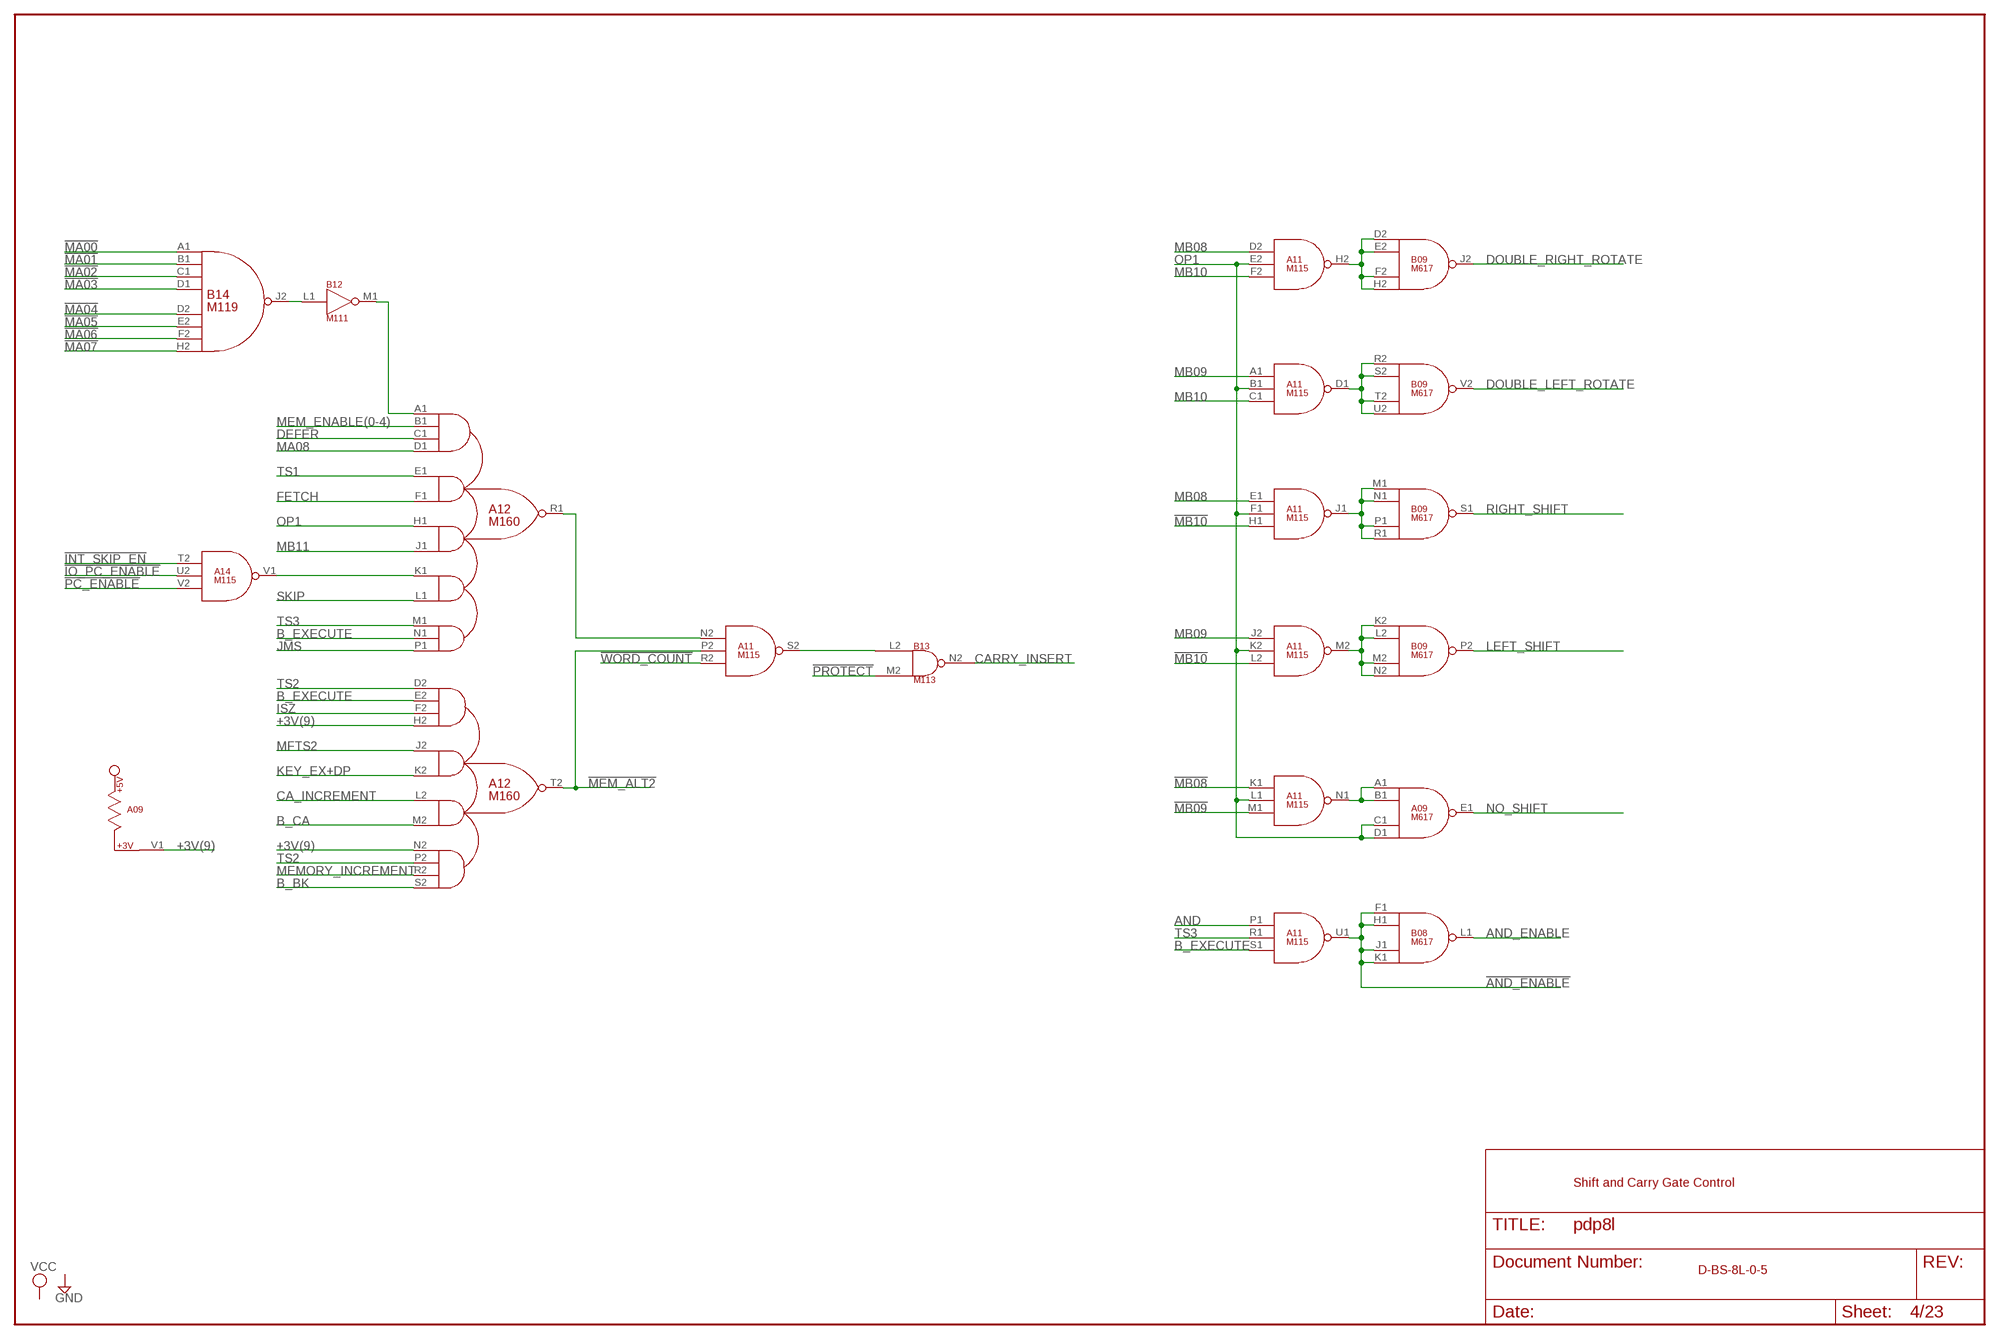
[diagram p3: schematic, sheet 4]

### Parts
A11  M115  [H807]
A14  M115  [H807]
B14  M119  [H807]

### Nets
!AND_ENABLE: A11.U1(U1:OUT) B08.F1(L1:IN1) B08.H1(L1:IN2) B08.J1(L1:IN3) B08.K1(L1:IN4) ; also sheet 3
!DOUBLE_LEFT_ROTATE: A11.D1(D1:OUT) B09.R2(V2:IN1) B09.S2(V2:IN2) B09.T2(V2:IN3) B09.U2(V2:IN4)
!DOUBLE_RIGHT_ROTATE: A11.H2(H2:OUT) B09.D2(J2:IN1) B09.E2(J2:IN2) B09.F2(J2:IN3) B09.H2(J2:IN4)
!INT_SKIP_EN: A14.T2(V1:IN1) ; also sheet 3
!IO_PC_ENABLE: A14.U2(V1:IN2) ; also sheet 3
!LEFT_SHIFT: A11.M2(M2:OUT) B09.K2(P2:IN1) B09.L2(P2:IN2) B09.M2(P2:IN3) B09.N2(P2:IN4)
!MA00: B14.A1(J2:IN1) ; also sheet 7,17,19
!MA01: B14.B1(J2:IN2) ; also sheet 7,19
!MA02: B14.C1(J2:IN3) ; also sheet 7,19
!MA03: B14.D1(J2:IN4) ; also sheet 7,17,19
!MA04: B14.D2(J2:IN5) ; also sheet 7,19
!MA05: B14.E2(J2:IN6) ; also sheet 7,19
!MA06: B14.F2(J2:IN7) ; also sheet 7,18,19
!MA07: B14.H2(J2:IN8) ; also sheet 7,19
!MB08: A11.K1(N1:IN1) ; also sheet 5,6,7,12,14,16,20,21,23
!MB09: A11.M1(N1:IN3) ; also sheet 7,16,23
!MB10: A11.H1(J1:IN3) A11.L2(M2:IN3) ; also sheet 6,7,16,23
!MEM_ALT2: A11.P2(S2:IN2) A12.T2(T2:OUT) ; also sheet 2
!PC_ENABLE: A14.V2(V1:IN3) ; also sheet 3
!PROTECT: B13.M2(N2:IN2) ; also sheet 2,3
!RIGHT_SHIFT: A11.J1(J1:OUT) B09.M1(S1:IN1) B09.N1(S1:IN2) B09.P1(S1:IN3) B09.R1(S1:IN4)
!WORD_COUNT: A11.R2(S2:IN3) ; also sheet 2,6,19
+3V(9): A09.V1 A12.H2(T2:IN1D) A12.N2(T2:IN4A)
A11N1: A09.A1(E1:IN1) A09.B1(E1:IN2) A11.N1(N1:OUT)
A11S2: A11.S2(S2:OUT) B13.L2(N2:IN1)
A12R1: A11.N2(S2:IN1) A12.R1(R1:OUT)
A14V1: A12.K1(R1:IN4A) A14.V1(V1:OUT)
AND: A11.P1(U1:IN1) ; also sheet 2
AND_ENABLE: B08.L1(L1:OUT) ; also sheet 8,9,10,11
B12M1: A12.A1(R1:IN1A) B12.M1(M1:OUT)
B14J2: B12.L1(M1:IN) B14.J2(J2:OUT)
B_BK: A12.S2(T2:IN4D) ; also sheet 2,3
B_CA: A12.M2(T2:IN3B) ; also sheet 2,3
B_EXECUTE: A11.S1(U1:IN3) A12.E2(T2:IN1B) A12.N1(R1:IN5B) ; also sheet 2,3,5
CA_INCREMENT: A12.L2(T2:IN3A) ; also sheet 12
CARRY_INSERT: B13.N2(N2:OUT) ; also sheet 11
DEFER: A12.C1(R1:IN1C) ; also sheet 2,3,5,19
DOUBLE_LEFT_ROTATE: B09.V2(V2:OUT) ; also sheet 7,8,9,10,11
DOUBLE_RIGHT_ROTATE: B09.J2(J2:OUT) ; also sheet 7,8,9,10,11
FETCH: A12.F1(R1:IN2B) ; also sheet 2
ISZ: A12.F2(T2:IN1C) ; also sheet 2,5
JMS: A12.P1(R1:IN5C) ; also sheet 2,3,5
KEY_EX+DP: A12.K2(T2:IN2B) ; also sheet 1,3
LEFT_SHIFT: B09.P2(P2:OUT) ; also sheet 7,8,9,10,11
MA08: A12.D1(R1:IN1D) ; also sheet 7,18
MB08: A11.D2(H2:IN1) A11.E1(J1:IN1) ; also sheet 5,7,12,13,22,23
MB09: A11.A1(D1:IN1) A11.J2(M2:IN1) ; also sheet 1,3,7,12,23
MB10: A11.C1(D1:IN3) A11.F2(H2:IN3) ; also sheet 1,7,12,23
MB11: A12.J1(R1:IN3B) ; also sheet 1,7,12,23
MEM_ENABLE(0-4): A12.B1(R1:IN1B) ; also sheet 3,8,9
MEMORY_INCREMENT: A12.R2(T2:IN4C) ; also sheet 6,12
MFTS2: A12.J2(T2:IN2A) ; also sheet 1,3
NO_SHIFT: A09.E1(E1:OUT) ; also sheet 7,8,9,10,11
OP1: A09.C1(E1:IN3) A09.D1(E1:IN4) A11.B1(D1:IN2) A11.E2(H2:IN2) A11.F1(J1:IN2) A11.K2(M2:IN2) A11.L1(N1:IN2) A12.H1(R1:IN3A) ; also sheet 2,3
RIGHT_SHIFT: B09.S1(S1:OUT) ; also sheet 7,8,9,10,11
SKIP: A12.L1(R1:IN4B) ; also sheet 5
TS1: A12.E1(R1:IN2A) ; also sheet 1,3
TS2: A12.D2(T2:IN1A) A12.P2(T2:IN4B) ; also sheet 1,2,3,5
TS3: A11.R1(U1:IN2) A12.M1(R1:IN5A) ; also sheet 1,2,3
Unconnected: B14.V1

### Notes on the sheet
- Shift and Carry Gate Control
- D-BS-8L-0-5

## Sheet 5 of 23
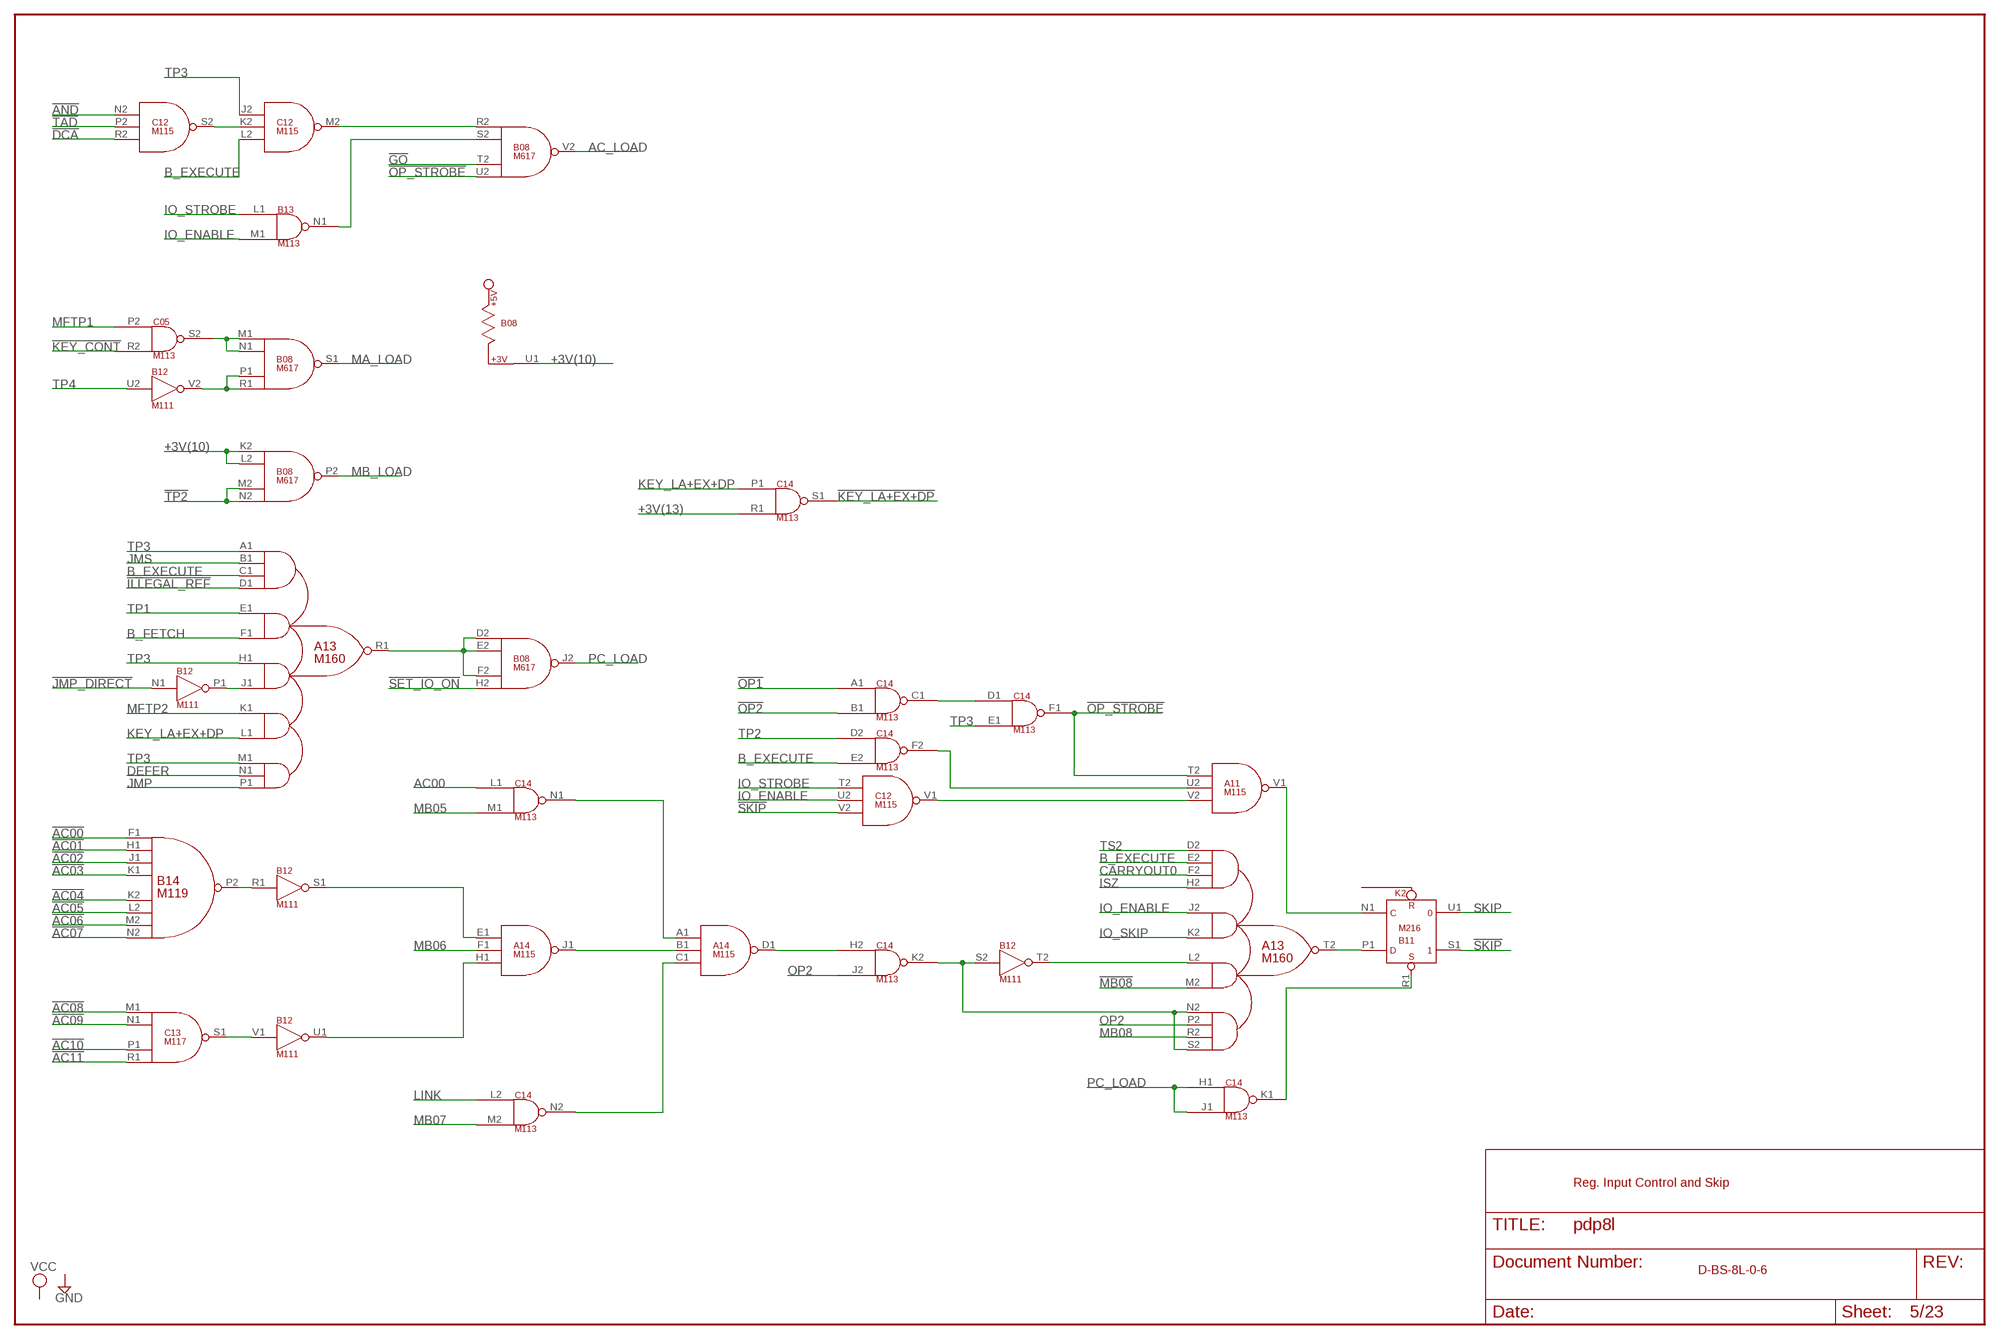
[diagram p4: schematic, sheet 5]

### Parts
C14  M113  [H807]

### Nets
!AC00: B14.F1(P2:IN1) ; also sheet 7
!AC01: B14.H1(P2:IN2) ; also sheet 7
!AC02: B14.J1(P2:IN3) ; also sheet 7
!AC03: B14.K1(P2:IN4) ; also sheet 7
!AC04: B14.K2(P2:IN5) ; also sheet 7
!AC05: B14.L2(P2:IN6) ; also sheet 7
!AC06: B14.M2(P2:IN7) ; also sheet 7
!AC07: B14.N2(P2:IN8) ; also sheet 7
!AC08: C13.M1(S1:IN1) ; also sheet 7
!AC09: C13.N1(S1:IN2) ; also sheet 7
!AC10: C13.P1(S1:IN3) ; also sheet 7
!AC11: C13.R1(S1:IN4) ; also sheet 7
!AND: C12.N2(S2:IN1) ; also sheet 2
!DCA: C12.R2(S2:IN3) ; also sheet 2
!GO: B08.T2(V2:IN3) ; also sheet 2,6
!ILLEGAL_REF: A13.D1(R1:IN1D) ; also sheet 1,2
!JMP_DIRECT: B12.N1(P1:IN) ; also sheet 3
!KEY_CONT: C05.R2(S2:IN2) ; also sheet 1
!KEY_LA+EX+DP: C14.S1(S1:OUT) ; also sheet 6
!MB08: A13.M2(T2:IN3B) ; also sheet 4,6,7,12,14,16,20,21,23
!OP1: C14.A1(C1:IN1) ; also sheet 2
!OP2: C14.B1(C1:IN2) ; also sheet 2
!OP_STROBE: A11.T2(V1:IN1) B08.U2(V2:IN4) C14.F1(F1:OUT)
!PC_LOAD: B11.R1(S1:S) C14.K1(K1:OUT)
!SET_IO_ON: B08.H2(J2:IN4) ; also sheet 1
!SKIP: B11.S1 C12.V2(V1:IN3)
!TAD: C12.P2(S2:IN2) ; also sheet 2
!TP2: B08.M2(P2:IN3) B08.N2(P2:IN4) ; also sheet 1
!TP4: B08.P1(S1:IN3) B08.R1(S1:IN4) B12.V2(V2:OUT)
+3V(10): B08.K2(P2:IN1) B08.L2(P2:IN2) B08.U1
+3V(13): C14.R1(S1:IN2) ; also sheet 15
A11V1: A11.V1(V1:OUT) B11.N1(S1:C)
A13R1: A13.R1(R1:OUT) B08.D2(J2:IN1) B08.E2(J2:IN2) B08.F2(J2:IN3)
A13T2: A13.T2(T2:OUT) B11.P1(S1:D)
A14D1: A14.D1(D1:OUT) C14.H2(K2:IN1)
A14J1: A14.B1(D1:IN2) A14.J1(J1:OUT)
AC00: C14.L1(N1:IN1) ; also sheet 7,12
AC_LOAD: B08.V2(V2:OUT) ; also sheet 7
B12S1: A14.E1(J1:IN1) B12.S1(S1:OUT)
B12T2: A13.L2(T2:IN3A) B12.T2(T2:OUT)
B12U1: A14.H1(J1:IN3) B12.U1(U1:OUT)
B13N1: B08.S2(V2:IN2) B13.N1(N1:OUT)
B14P2: B12.R1(S1:IN) B14.P2(P2:OUT)
B_EXECUTE: A13.C1(R1:IN1C) A13.E2(T2:IN1B) C12.L2(M2:IN3) C14.E2(F2:IN2) ; also sheet 2,3,4
B_FETCH: A13.F1(R1:IN2B) ; also sheet 2,3,6
C05S2: B08.M1(S1:IN1) B08.N1(S1:IN2) C05.S2(S2:OUT)
C12M2: B08.R2(V2:IN1) C12.M2(M2:OUT)
C12S2: C12.K2(M2:IN2) C12.S2(S2:OUT)
C12V1: A11.V2(V1:IN3) C12.V1(V1:OUT)
C13S1: B12.V1(U1:IN) C13.S1(S1:OUT)
C14C1: C14.C1(C1:OUT) C14.D1(F1:IN1)
C14F2: A11.U2(V1:IN2) C14.F2(F2:OUT)
C14K2: A13.N2(T2:IN4A) A13.S2(T2:IN4D) B12.S2(T2:IN) C14.K2(K2:OUT)
C14N1: A14.A1(D1:IN1) C14.N1(N1:OUT)
C14N2: A14.C1(D1:IN3) C14.N2(N2:OUT)
CARRYOUT0: A13.F2(T2:IN1C) ; also sheet 6,7
DEFER: A13.N1(R1:IN5B) ; also sheet 2,3,4,19
IO_ENABLE: A13.J2(T2:IN2A) B13.M1(N1:IN2) C12.U2(V1:IN2) ; also sheet 3,8,9,10,11
IO_SKIP: A13.K2(T2:IN2B) ; also sheet 12
IO_STROBE: B13.L1(N1:IN1) C12.T2(V1:IN1) ; also sheet 1
ISZ: A13.H2(T2:IN1D) ; also sheet 2,4
JMP: A13.P1(R1:IN5C) ; also sheet 2,3
JMP_DIRECT: A13.J1(R1:IN3B) B12.P1(P1:OUT)
JMS: A13.B1(R1:IN1B) ; also sheet 2,3,4
KEY_LA+EX+DP: A13.L1(R1:IN4B) C14.P1(S1:IN1) ; also sheet 1
LINK: C14.L2(N2:IN1) ; also sheet 7
MA_LOAD: B08.S1(S1:OUT) ; also sheet 7
MB05: C14.M1(N1:IN2) ; also sheet 3,7,12,20,23
MB06: A14.F1(J1:IN2) ; also sheet 3,7,12,14,23
MB07: C14.M2(N2:IN2) ; also sheet 3,7,12,13,21,23
MB08: A13.R2(T2:IN4C) ; also sheet 4,7,12,13,22,23
MB_LOAD: B08.P2(P2:OUT) ; also sheet 7
MFTP1: C05.P2(S2:IN1) ; also sheet 1,19
MFTP2: A13.K1(R1:IN4A) ; also sheet 1,2
OP2: A13.P2(T2:IN4B) C14.J2(K2:IN2) ; also sheet 1,2,3
PC_LOAD: B08.J2(J2:OUT) C14.H1(K1:IN1) C14.J1(K1:IN2) ; also sheet 7
SKIP: B11.U1 ; also sheet 4
TP1: A13.E1(R1:IN2A) ; also sheet 1,2,6
TP2: C14.D2(F2:IN1) ; also sheet 1,2,6
TP3: A13.A1(R1:IN1A) A13.H1(R1:IN3A) A13.M1(R1:IN5A) C12.J2(M2:IN1) C14.E1(F1:IN2) ; also sheet 1,23
TP4: B12.U2(V2:IN) ; also sheet 1,2,6
TS2: A13.D2(T2:IN1A) ; also sheet 1,2,3,4
Unconnected: C14.U1 C14.V1

### Notes on the sheet
- Reg. Input Control and Skip
- D-BS-8L-0-6

## Sheet 6 of 23
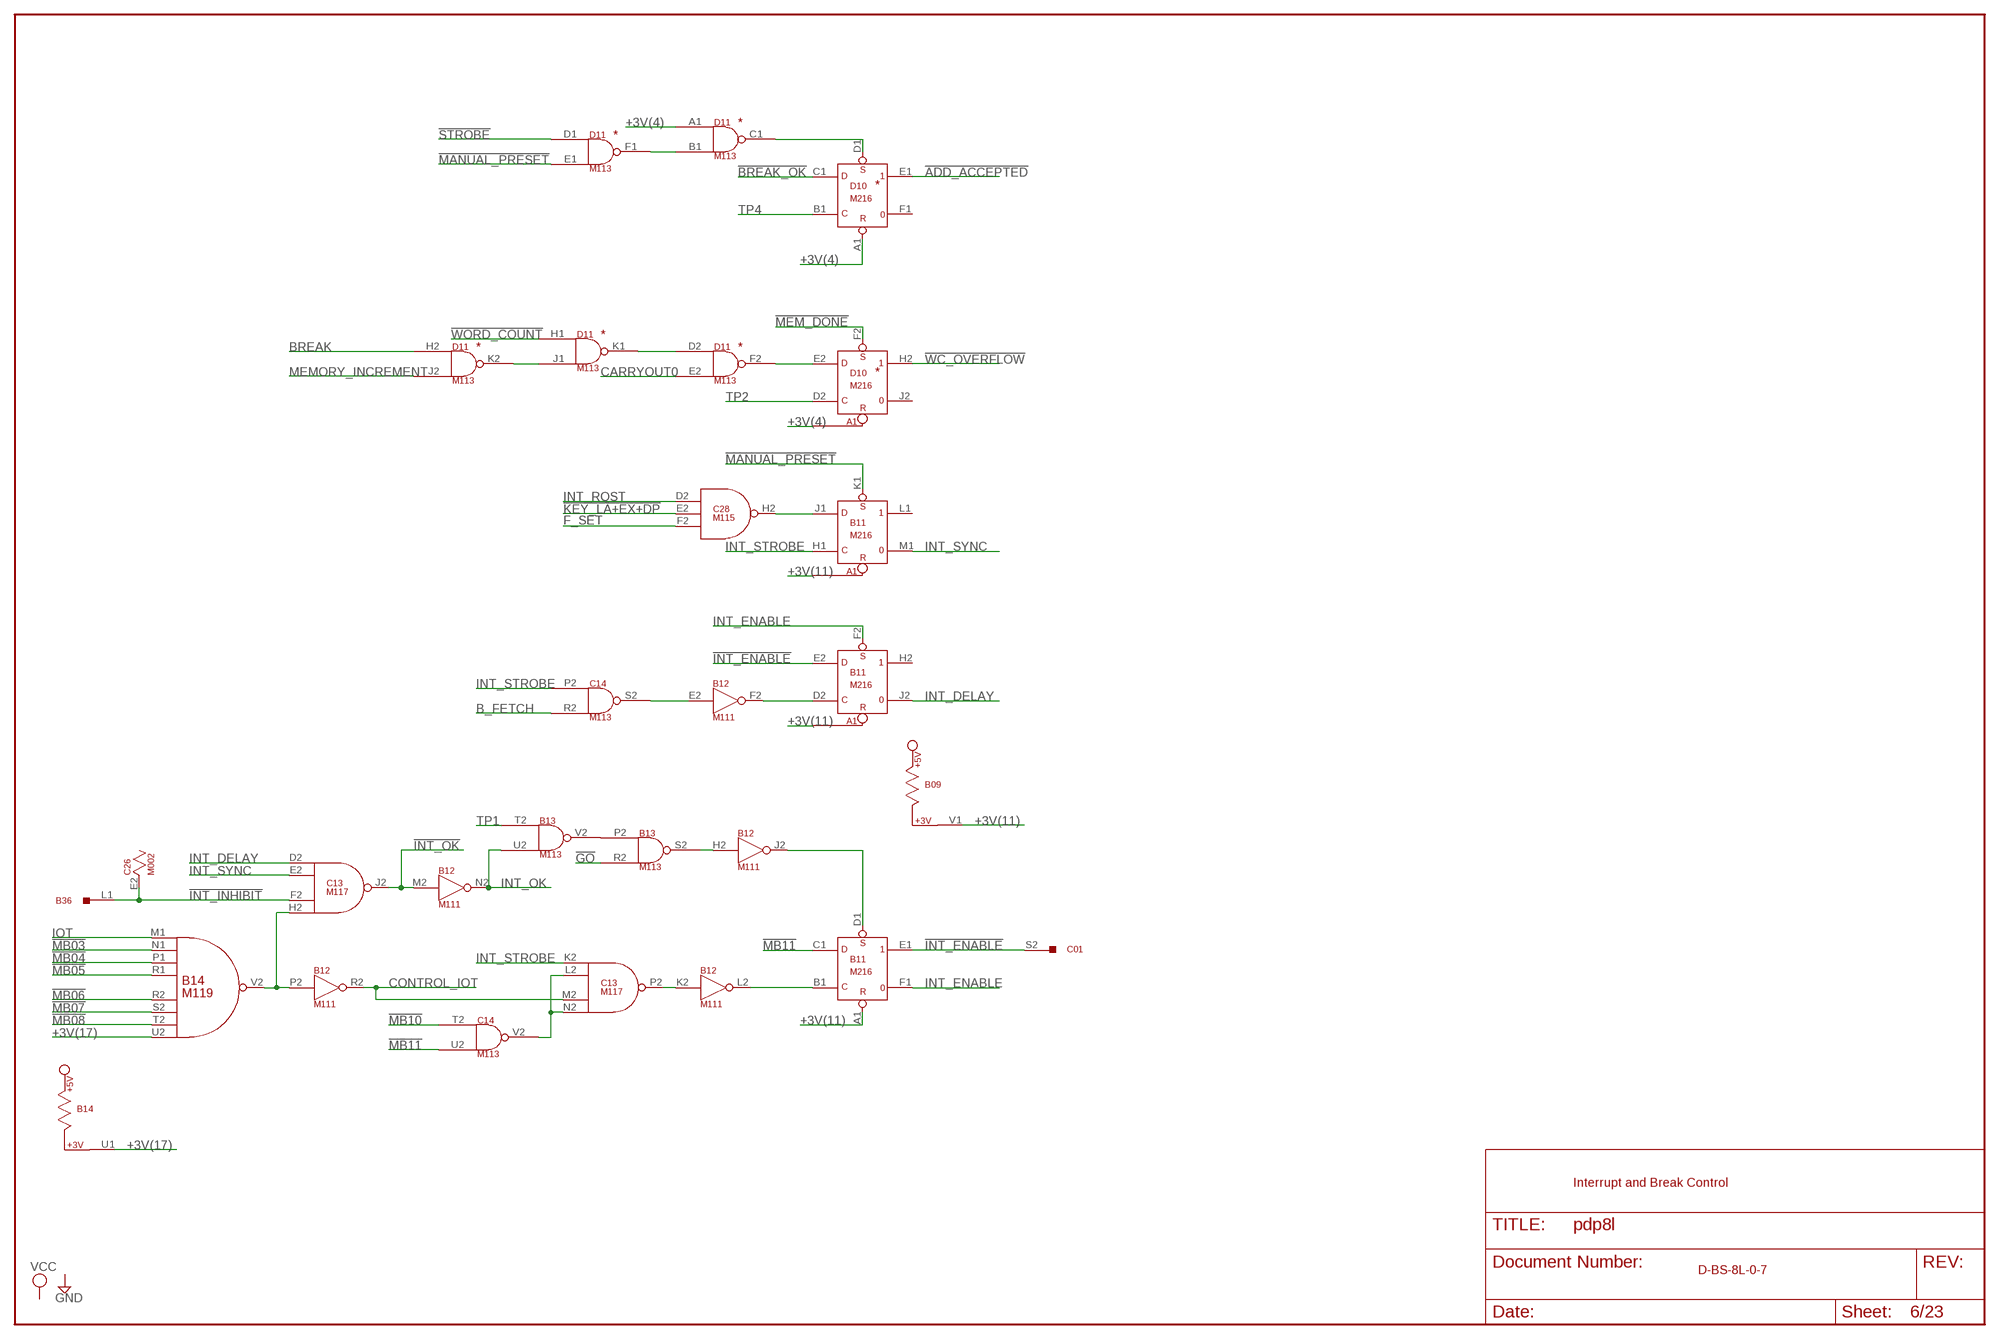
[diagram p5: schematic, sheet 6]

### Nets
!ADD_ACCEPTED: D10.E1 ; also sheet 12
!BREAK_OK: D10.C1(E1:D) ; also sheet 2
!GO: B13.R2(S2:IN2) ; also sheet 2,5
!INT_ENABLE: B11.E1 B11.E2(H2:D) C01.S2
!INT_INHIBIT: B36.L1 C13.F2(J2:IN3) C26.E2
!INT_OK: B12.M2(N2:IN) C13.J2(J2:OUT) ; also sheet 2,3
!KEY_LA+EX+DP: C28.E2(H2:IN2) ; also sheet 5
!MANUAL_PRESET: B11.K1(L1:S) D11.E1(F1:IN2) ; also sheet 1,2
!MB03: B14.N1(V2:IN2) ; also sheet 2,3,7,12,13,14,16,20,21,22,23
!MB04: B14.P1(V2:IN3) ; also sheet 3,7,12,13,14,16,20,21,22,23
!MB05: B14.R1(V2:IN4) ; also sheet 3,7,12,13,14,16,21,22,23
!MB06: B14.R2(V2:IN5) ; also sheet 3,7,12,13,16,20,21,22,23
!MB07: B14.S2(V2:IN6) ; also sheet 3,7,12,14,16,20,22,23
!MB08: B14.T2(V2:IN7) ; also sheet 4,5,7,12,14,16,20,21,23
!MB10: C14.T2(V2:IN1) ; also sheet 4,7,16,23
!MB11: B11.C1(E1:D) C14.U2(V2:IN2) ; also sheet 1,2,3,7,16,23
!MEM_DONE: D10.F2(H2:S) ; also sheet 1,15
!STROBE: D11.D1(F1:IN1) ; also sheet 1,15
!WC_OVERFLOW: D10.H2 ; also sheet 12
!WORD_COUNT: D11.H1(K1:IN1) ; also sheet 2,4,19
+3V(4): D10.A1(E1:R) D11.A1(C1:IN1) ; also sheet 2
+3V(11): B09.V1 B11.A1(E1:R) ; also sheet 7
+3V(17): B14.U1 B14.U2(V2:IN8)
B12F2: B11.D2(H2:C) B12.F2(F2:OUT)
B12J2: B11.D1(E1:S) B12.J2(J2:OUT)
B12L2: B11.B1(E1:C) B12.L2(L2:OUT)
B13S2: B12.H2(J2:IN) B13.S2(S2:OUT)
B13V2: B13.P2(S2:IN1) B13.V2(V2:OUT)
B14V2: B12.P2(R2:IN) B14.V2(V2:OUT) C13.H2(J2:IN4)
B_FETCH: C14.R2(S2:IN2) ; also sheet 2,3,5
BREAK: D11.H2(K2:IN1) ; also sheet 2
C13P2: B12.K2(L2:IN) C13.P2(P2:OUT)
C14S2: B12.E2(F2:IN) C14.S2(S2:OUT)
C14V2: C13.L2(P2:IN2) C13.N2(P2:IN4) C14.V2(V2:OUT)
C28H2: B11.J1(L1:D) C28.H2(H2:OUT)
CARRYOUT0: D11.E2(F2:IN2) ; also sheet 5,7
CONTROL_IOT: B12.R2(R2:OUT) C13.M2(P2:IN3)
D11C1: D10.D1(E1:S) D11.C1(C1:OUT)
D11F1: D11.B1(C1:IN2) D11.F1(F1:OUT)
D11F2: D10.E2(H2:D) D11.F2(F2:OUT)
D11K1: D11.D2(F2:IN1) D11.K1(K1:OUT)
D11K2: D11.J1(K1:IN2) D11.K2(K2:OUT)
F_SET: C28.F2(H2:IN3) ; also sheet 1,2,3
INT_DELAY: B11.J2 C13.D2(J2:IN1)
INT_ENABLE: B11.F1 B11.F2(H2:S)
INT_OK: B12.N2(N2:OUT) B13.U2(V2:IN2) ; also sheet 2,19
INT_RQST: C28.D2(H2:IN1) ; also sheet 12
INT_STROBE: B11.H1(L1:C) C13.K2(P2:IN1) C14.P2(S2:IN1) ; also sheet 1
INT_SYNC: B11.M1 C13.E2(J2:IN2)
IOT: B14.M1(V2:IN1) ; also sheet 1,2
MEMORY_INCREMENT: D11.J2(K2:IN2) ; also sheet 4,12
TP1: B13.T2(V2:IN1) ; also sheet 1,2,5
TP2: D10.D2(H2:C) ; also sheet 1,2,5
TP4: D10.B1(E1:C) ; also sheet 1,2,5
Unconnected: B11.H2 B11.L1 D10.F1 D10.J2

### Notes on the sheet
- *
- *
- *
- *
- * | *
- *
- Interrupt and Break Control
- D-BS-8L-0-7

## Sheet 7 of 23
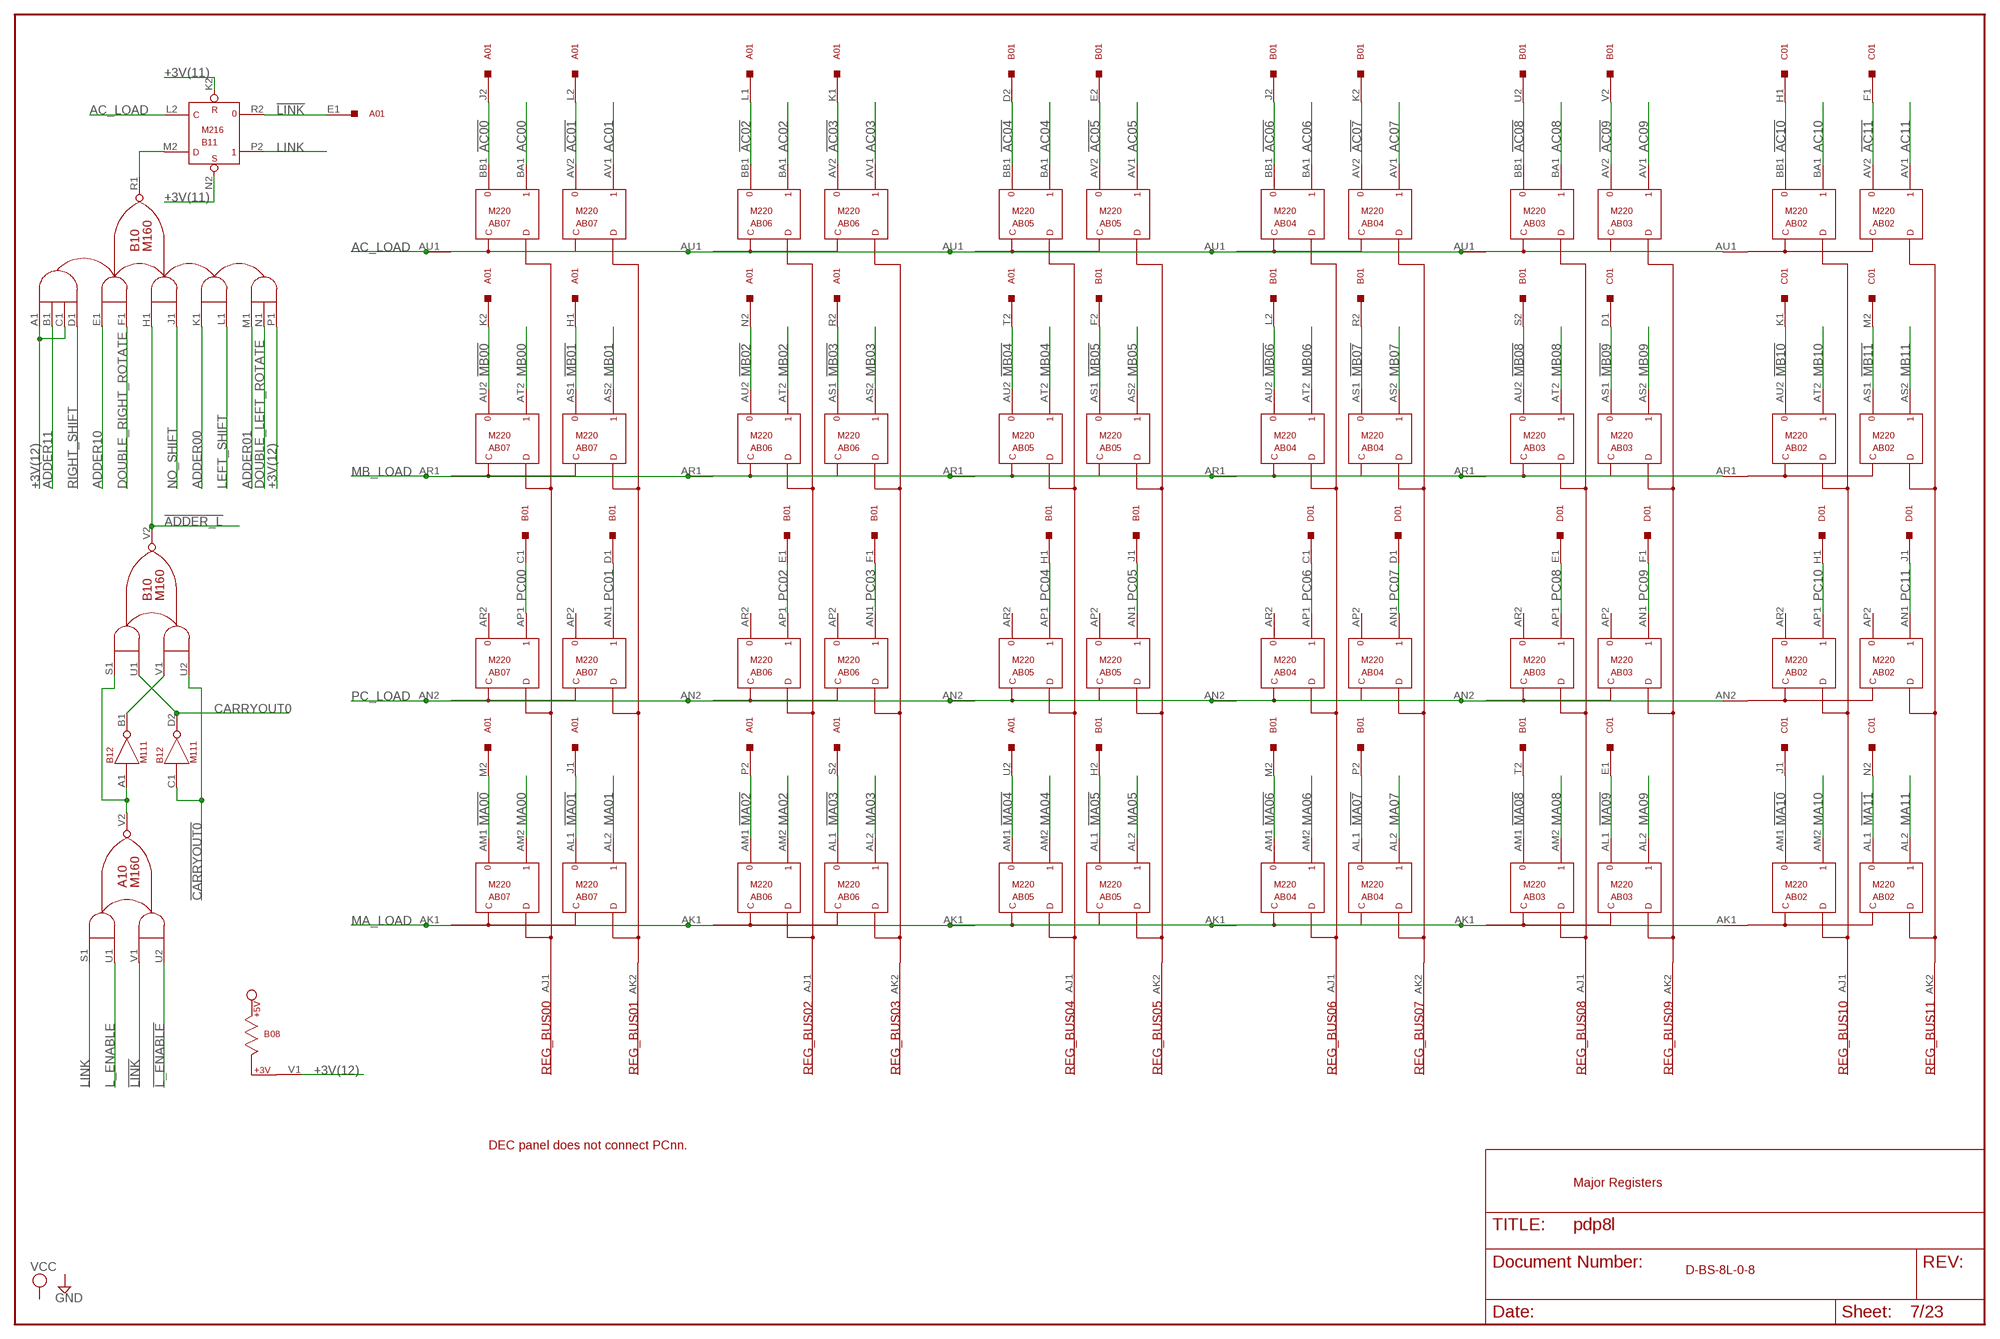
[diagram p6: schematic, sheet 7]

### Parts
AB02  M220  [H807-2]
AB03  M220  [H807-2]
AB04  M220  [H807-2]
AB05  M220  [H807-2]
AB06  M220  [H807-2]
AB07  M220  [H807-2]
B01  G921  M916  [H807]

### Nets
!AC00: A01.J2 AB07.BB1 ; also sheet 5
!AC01: A01.L2 AB07.AV2 ; also sheet 5
!AC02: A01.L1 AB06.BB1 ; also sheet 5
!AC03: A01.K1 AB06.AV2 ; also sheet 5
!AC04: AB05.BB1 B01.D2 ; also sheet 5
!AC05: AB05.AV2 B01.E2 ; also sheet 5
!AC06: AB04.BB1 B01.J2 ; also sheet 5
!AC07: AB04.AV2 B01.K2 ; also sheet 5
!AC08: AB03.BB1 B01.U2 ; also sheet 5
!AC09: AB03.AV2 B01.V2 ; also sheet 5
!AC10: AB02.BB1 C01.H1 ; also sheet 5
!AC11: AB02.AV2 C01.F1 ; also sheet 5
!ADDER_L: B10.H1(R1:IN3A) B10.V2(V2:OUT) ; also sheet 8,11
!CARRYOUT0: B10.U2(V2:IN2B) B12.C1(D2:IN) ; also sheet 8
!L_ENABLE: A10.U2(V2:IN2B) ; also sheet 3
!LINK: A01.E1 A10.V1(V2:IN2A) B11.R2
!MA00: A01.M2 AB07.AM1 ; also sheet 4,17,19
!MA01: A01.J1 AB07.AL1 ; also sheet 4,19
!MA02: A01.P2 AB06.AM1 ; also sheet 4,19
!MA03: A01.S2 AB06.AL1 ; also sheet 4,17,19
!MA04: A01.U2 AB05.AM1 ; also sheet 4,19
!MA05: AB05.AL1 B01.H2 ; also sheet 4,19
!MA06: AB04.AM1 B01.M2 ; also sheet 4,18,19
!MA07: AB04.AL1 B01.P2 ; also sheet 4,19
!MA08: AB03.AM1 B01.T2 ; also sheet 19
!MA09: AB03.AL1 C01.E1 ; also sheet 18,19
!MA10: AB02.AM1 C01.J1 ; also sheet 19
!MA11: AB02.AL1 C01.N2 ; also sheet 19
!MB00: A01.K2 AB07.AU2 ; also sheet 16,23
!MB01: A01.H1 AB07.AS1 ; also sheet 16,23
!MB02: A01.N2 AB06.AU2 ; also sheet 16,23
!MB03: A01.R2 AB06.AS1 ; also sheet 2,3,6,12,13,14,16,20,21,22,23
!MB04: A01.T2 AB05.AU2 ; also sheet 3,6,12,13,14,16,20,21,22,23
!MB05: AB05.AS1 B01.F2 ; also sheet 3,6,12,13,14,16,21,22,23
!MB06: AB04.AU2 B01.L2 ; also sheet 3,6,12,13,16,20,21,22,23
!MB07: AB04.AS1 B01.R2 ; also sheet 3,6,12,14,16,20,22,23
!MB08: AB03.AU2 B01.S2 ; also sheet 4,5,6,12,14,16,20,21,23
!MB09: AB03.AS1 C01.D1 ; also sheet 4,16,23
!MB10: AB02.AU2 C01.K1 ; also sheet 4,6,16,23
!MB11: AB02.AS1 C01.M2 ; also sheet 1,2,3,6,16,23
+3V(11): B11.K2(P2:R) B11.N2(P2:S) ; also sheet 6
+3V(12): B08.V1 B10.A1(R1:IN1A) B10.C1(R1:IN1C) B10.P1(R1:IN5C)
A10V2: A10.V2(V2:OUT) B10.S1(V2:IN1A) B12.A1(B1:IN)
AC00: AB07.BA1 ; also sheet 5,12
AC01: AB07.AV1 ; also sheet 12
AC02: AB06.BA1 ; also sheet 12
AC03: AB06.AV1 ; also sheet 12
AC04: AB05.BA1 ; also sheet 12,14,21
AC05: AB05.AV1 ; also sheet 12,14,21
AC06: AB04.BA1 ; also sheet 12,14,21
AC07: AB04.AV1 ; also sheet 12,14,21
AC08: AB03.BA1 ; also sheet 12,14,21
AC09: AB03.AV1 ; also sheet 12,14,21
AC10: AB02.BA1 ; also sheet 12,14,21
AC11: AB02.AV1 ; also sheet 12,14,21
AC_LOAD: AB02.AU1 AB03.AU1 AB04.AU1 AB05.AU1 AB06.AU1 AB07.AU1 B11.L2(P2:C) ; also sheet 5
ADDER00: B10.K1(R1:IN4A) ; also sheet 8,11
ADDER01: B10.M1(R1:IN5A) ; also sheet 8
ADDER10: B10.E1(R1:IN2A) ; also sheet 10,11
ADDER11: B10.B1(R1:IN1B) ; also sheet 8,10,11
B10R1: B10.R1(R1:OUT) B11.M2(P2:D)
B12B1: B10.V1(V2:IN2A) B12.B1(B1:OUT)
CARRYOUT0: B10.U1(V2:IN1B) B12.D2(D2:OUT) ; also sheet 5,6
DOUBLE_LEFT_ROTATE: B10.N1(R1:IN5B) ; also sheet 4,8,9,10,11
DOUBLE_RIGHT_ROTATE: B10.F1(R1:IN2B) ; also sheet 4,8,9,10,11
L_ENABLE: A10.U1(V2:IN1B) ; also sheet 3
LEFT_SHIFT: B10.L1(R1:IN4B) ; also sheet 4,8,9,10,11
LINK: A10.S1(V2:IN1A) B11.P2 ; also sheet 5
MA00: AB07.AM2 ; also sheet 2,17
MA01: AB07.AL2 ; also sheet 2,17
MA02: AB06.AM2 ; also sheet 2,17
MA03: AB06.AL2 ; also sheet 2,17
MA04: AB05.AM2 ; also sheet 2,17
MA05: AB05.AL2 ; also sheet 17
MA06: AB04.AM2 ; also sheet 18
MA07: AB04.AL2 ; also sheet 18
MA08: AB03.AM2 ; also sheet 4,18
MA09: AB03.AL2 ; also sheet 18
MA10: AB02.AM2 ; also sheet 18
MA11: AB02.AL2 ; also sheet 18
MA_LOAD: AB02.AK1 AB03.AK1 AB04.AK1 AB05.AK1 AB06.AK1 AB07.AK1 ; also sheet 5
MB00: AB07.AT2 ; also sheet 12,23
MB01: AB07.AS2 ; also sheet 12,23
MB02: AB06.AT2 ; also sheet 12,23
MB03: AB06.AS2 ; also sheet 2,12,23
MB04: AB05.AT2 ; also sheet 3,12,23
MB05: AB05.AS2 ; also sheet 3,5,12,20,23
MB06: AB04.AT2 ; also sheet 3,5,12,14,23
MB07: AB04.AS2 ; also sheet 3,5,12,13,21,23
MB08: AB03.AT2 ; also sheet 4,5,12,13,22,23
MB09: AB03.AS2 ; also sheet 1,3,4,12,23
MB10: AB02.AT2 ; also sheet 1,4,12,23
MB11: AB02.AS2 ; also sheet 1,4,12,23
MB_LOAD: AB02.AR1 AB03.AR1 AB04.AR1 AB05.AR1 AB06.AR1 AB07.AR1 ; also sheet 5
NO_SHIFT: B10.J1(R1:IN3B) ; also sheet 4,8,9,10,11
PC00: AB07.AP1 B01.C1
PC01: AB07.AN1 B01.D1
PC02: AB06.AP1 B01.E1
PC03: AB06.AN1 B01.F1
PC04: AB05.AP1 B01.H1
PC05: AB05.AN1 B01.J1
PC06: AB04.AP1 D01.C1
PC07: AB04.AN1 D01.D1
PC08: AB03.AP1 D01.E1
PC09: AB03.AN1 D01.F1
PC10: AB02.AP1 D01.H1
PC11: AB02.AN1 D01.J1
PC_LOAD: AB02.AN2 AB03.AN2 AB04.AN2 AB05.AN2 AB06.AN2 AB07.AN2 ; also sheet 5
RIGHT_SHIFT: B10.D1(R1:IN1D) ; also sheet 4,8,9,10,11
Unconnected: AB02.AJ1 AB02.AK2 AB02.AP2 AB02.AR2 AB03.AJ1 AB03.AK2 AB03.AP2 AB03.AR2 AB04.AJ1 AB04.AK2 AB04.AP2 AB04.AR2 AB05.AJ1 AB05.AK2 AB05.AP2 AB05.AR2 AB06.AJ1 AB06.AK2 AB06.AP2 AB06.AR2 AB07.AJ1 AB07.AK2 AB07.AP2 AB07.AR2 B01.A1 B01.B1 B01.B2 B01.K1 B01.L1 B01.M1 B01.N1 B01.P1 B01.R1 B01.S1 B01.U1

### Notes on the sheet
- REG_BUS00 | REG_BUS01 | REG_BUS02 | REG_BUS03 | REG_BUS04 | REG_BUS05 | REG_BUS06 | REG_BUS07 | REG_BUS08 | REG_BUS09 | REG_BUS10 | REG_BUS11
- DEC panel does not connect PCnn.
- Major Registers
- D-BS-8L-0-8

## Sheet 8 of 23
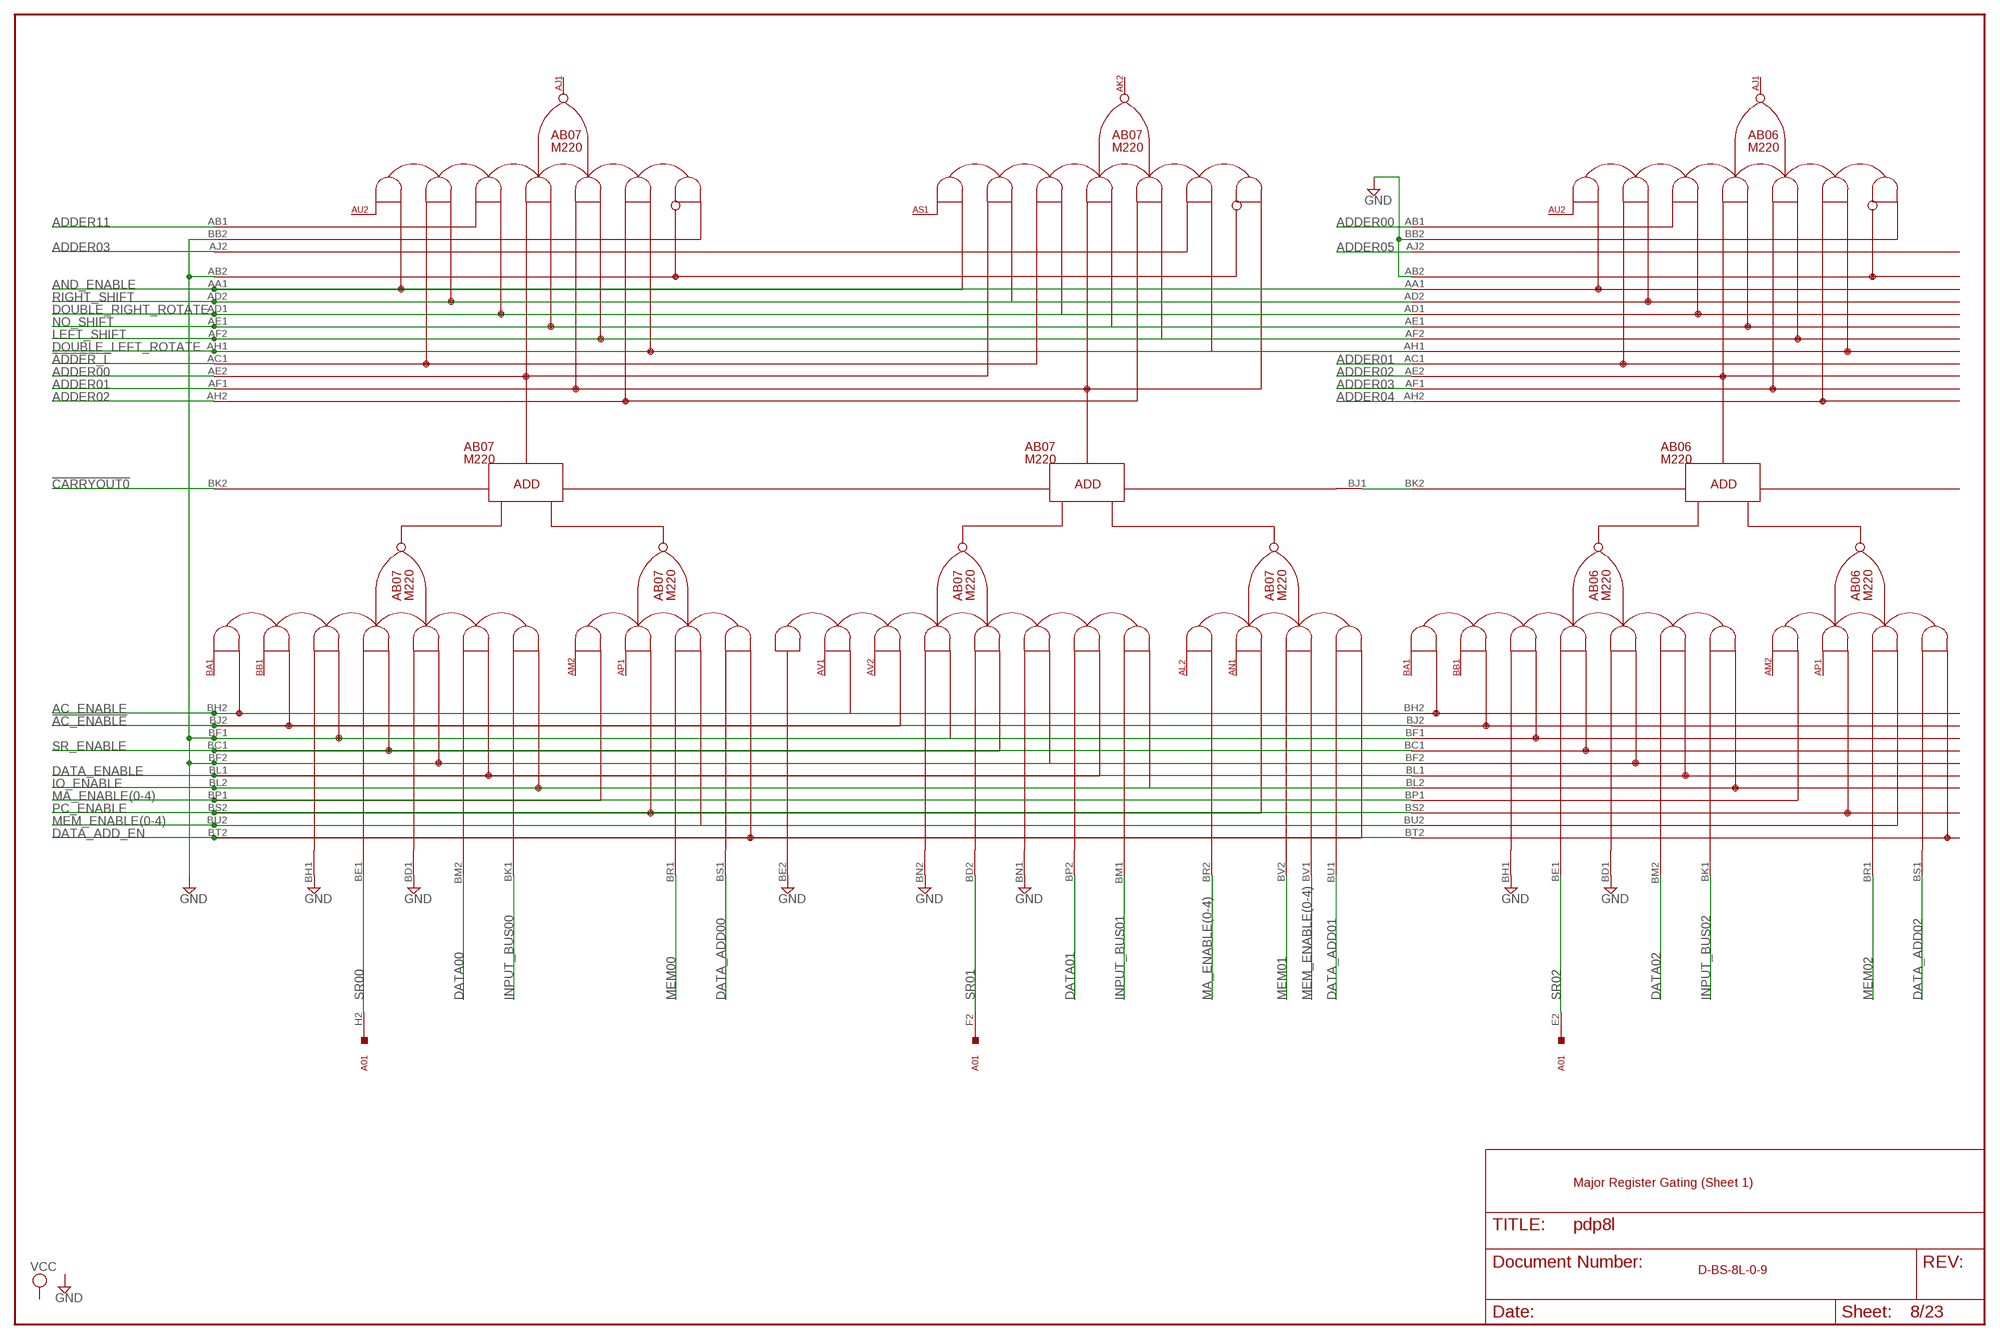
[diagram p7: schematic, sheet 8]

### Nets
!AC_ENABLE: AB06.BJ2(B0:BJ2) AB07.BJ2(B0:BJ2) ; also sheet 3,9,10,11
!ADDER_L: AB07.AC1(B0:AC1) ; also sheet 7,11
!CARRYOUT0: AB07.BK2(B0:BK2) ; also sheet 7
!CARRYOUT2: AB06.BK2(B0:BK2) AB07.BJ1(B1:BJ1)
AC_ENABLE: AB06.BH2(B0:BH2) AB07.BH2(B0:BH2) ; also sheet 3,9,10,11
ADDER00: AB06.AB1(B0:AB1) AB07.AE2(B0:AE2) ; also sheet 7,11
ADDER01: AB06.AC1(B0:AC1) AB07.AF1(B0:AF1) ; also sheet 7
ADDER02: AB06.AE2(B0:AE2) AB07.AH2(B0:AH2) ; also sheet 9
ADDER03: AB06.AF1(B0:AF1) AB07.AJ2(B0:AJ2) ; also sheet 9
ADDER04: AB06.AH2(B0:AH2) ; also sheet 9,10
ADDER05: AB06.AJ2(B0:AJ2) ; also sheet 9,10
ADDER11: AB07.AB1(B0:AB1) ; also sheet 7,10,11
AND_ENABLE: AB06.AA1(B0:AA1) AB07.AA1(B0:AA1) ; also sheet 4,9,10,11
DATA00: AB07.BM2(B0:BM2) ; also sheet 12
DATA01: AB07.BP2(B1:BP2) ; also sheet 12
DATA02: AB06.BM2(B0:BM2) ; also sheet 12
DATA_ADD00: AB07.BS1(B0:BS1) ; also sheet 12
DATA_ADD01: AB07.BU1(B1:BU1) ; also sheet 12
DATA_ADD02: AB06.BS1(B0:BS1) ; also sheet 12
DATA_ADD_EN: AB06.BT2(B0:BT2) AB07.BT2(B0:BT2) ; also sheet 3,9,10,11
DATA_ENABLE: AB06.BL1(B0:BL1) AB07.BL1(B0:BL1) ; also sheet 3,9,10,11
DOUBLE_LEFT_ROTATE: AB06.AH1(B0:AH1) AB07.AH1(B0:AH1) ; also sheet 4,7,9,10,11
DOUBLE_RIGHT_ROTATE: AB06.AD1(B0:AD1) AB07.AD1(B0:AD1) ; also sheet 4,7,9,10,11
GND [Supply]: AB06.AB2(B0:AB2) AB06.BB2(B0:BB2) AB06.BD1(B0:BD1) AB06.BF1(B0:BF1) AB06.BF2(B0:BF2) AB06.BH1(B0:BH1) AB07.AB2(B0:AB2) AB07.BB2(B0:BB2) AB07.BD1(B0:BD1) AB07.BE2(B1:BE2) AB07.BF1(B0:BF1) AB07.BF2(B0:BF2) AB07.BH1(B0:BH1) AB07.BN1(B1:BN1) AB07.BN2(B1:BN2) ; also sheet 1,3,9,10,11,12,13,14,15,16,19,20,21,23
INPUT_BUS00: AB07.BK1(B0:BK1) ; also sheet 12
INPUT_BUS01: AB07.BM1(B1:BM1) ; also sheet 12
INPUT_BUS02: AB06.BK1(B0:BK1) ; also sheet 12
IO_ENABLE: AB06.BL2(B0:BL2) AB07.BL2(B0:BL2) ; also sheet 3,5,9,10,11
LEFT_SHIFT: AB06.AF2(B0:AF2) AB07.AF2(B0:AF2) ; also sheet 4,7,9,10,11
MA_ENABLE(0-4): AB06.BP1(B0:BP1) AB07.BP1(B0:BP1) AB07.BR2(B1:BR2) ; also sheet 3,9
MEM00: AB07.BR1(B0:BR1) ; also sheet 2,16,23
MEM01: AB07.BV2(B1:BV2) ; also sheet 2,16,23
MEM02: AB06.BR1(B0:BR1) ; also sheet 2,16,23
MEM_ENABLE(0-4): AB06.BU2(B0:BU2) AB07.BU2(B0:BU2) AB07.BV1(B1:BV1) ; also sheet 3,4,9
NO_SHIFT: AB06.AE1(B0:AE1) AB07.AE1(B0:AE1) ; also sheet 4,7,9,10,11
PC_ENABLE: AB06.BS2(B0:BS2) AB07.BS2(B0:BS2) ; also sheet 3,9,10,11
RIGHT_SHIFT: AB06.AD2(B0:AD2) AB07.AD2(B0:AD2) ; also sheet 4,7,9,10,11
SR00: A01.H2 AB07.BE1(B0:BE1)
SR01: A01.F2 AB07.BD2(B1:BD2)
SR02: A01.E2 AB06.BE1(B0:BE1)
SR_ENABLE: AB06.BC1(B0:BC1) AB07.BC1(B0:BC1) ; also sheet 3,9,10,11

### Notes on the sheet
- Major Register Gating (Sheet 1)
- D-BS-8L-0-9

## Sheet 9 of 23
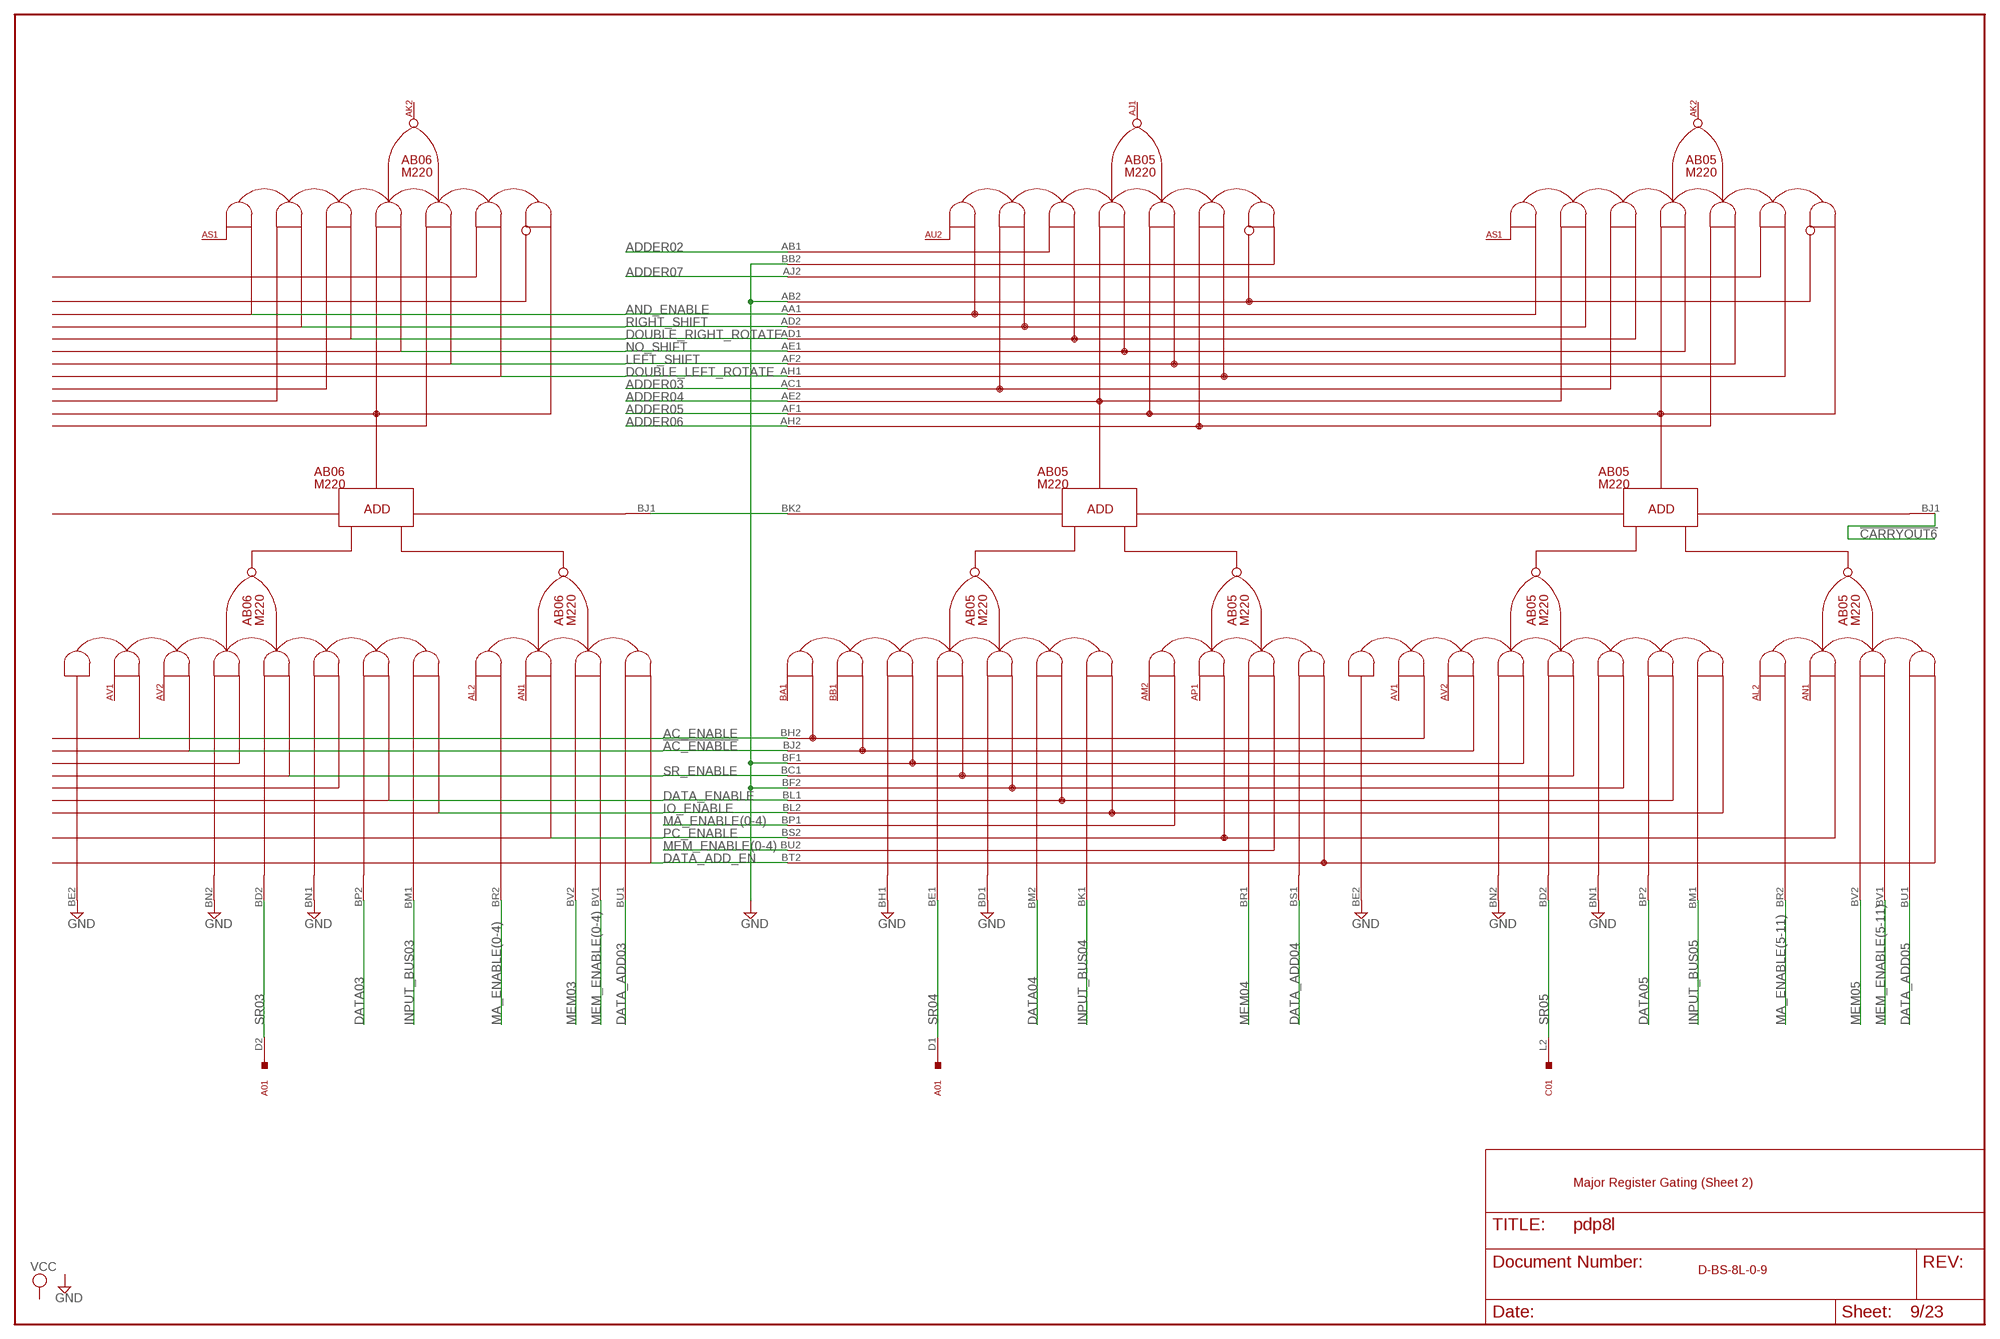
[diagram p8: schematic, sheet 9]

### Nets
!AC_ENABLE: AB05.BJ2(B0:BJ2) ; also sheet 3,8,10,11
!CARRYOUT4: AB05.BK2(B0:BK2) AB06.BJ1(B1:BJ1)
!CARRYOUT6: AB05.BJ1(B1:BJ1) ; also sheet 10
AC_ENABLE: AB05.BH2(B0:BH2) ; also sheet 3,8,10,11
ADDER02: AB05.AB1(B0:AB1) ; also sheet 8
ADDER03: AB05.AC1(B0:AC1) ; also sheet 8
ADDER04: AB05.AE2(B0:AE2) ; also sheet 8,10
ADDER05: AB05.AF1(B0:AF1) ; also sheet 8,10
ADDER06: AB05.AH2(B0:AH2) ; also sheet 10
ADDER07: AB05.AJ2(B0:AJ2) ; also sheet 10
AND_ENABLE: AB05.AA1(B0:AA1) ; also sheet 4,8,10,11
DATA03: AB06.BP2(B1:BP2) ; also sheet 12
DATA04: AB05.BM2(B0:BM2) ; also sheet 12
DATA05: AB05.BP2(B1:BP2) ; also sheet 12
DATA_ADD03: AB06.BU1(B1:BU1) ; also sheet 12
DATA_ADD04: AB05.BS1(B0:BS1) ; also sheet 12
DATA_ADD05: AB05.BU1(B1:BU1) ; also sheet 12
DATA_ADD_EN: AB05.BT2(B0:BT2) ; also sheet 3,8,10,11
DATA_ENABLE: AB05.BL1(B0:BL1) ; also sheet 3,8,10,11
DOUBLE_LEFT_ROTATE: AB05.AH1(B0:AH1) ; also sheet 4,7,8,10,11
DOUBLE_RIGHT_ROTATE: AB05.AD1(B0:AD1) ; also sheet 4,7,8,10,11
GND [Supply]: AB05.AB2(B0:AB2) AB05.BB2(B0:BB2) AB05.BD1(B0:BD1) AB05.BE2(B1:BE2) AB05.BF1(B0:BF1) AB05.BF2(B0:BF2) AB05.BH1(B0:BH1) AB05.BN1(B1:BN1) AB05.BN2(B1:BN2) AB06.BE2(B1:BE2) AB06.BN1(B1:BN1) AB06.BN2(B1:BN2) ; also sheet 1,3,8,10,11,12,13,14,15,16,19,20,21,23
INPUT_BUS03: AB06.BM1(B1:BM1) ; also sheet 12
INPUT_BUS04: AB05.BK1(B0:BK1) ; also sheet 12
INPUT_BUS05: AB05.BM1(B1:BM1) ; also sheet 12
IO_ENABLE: AB05.BL2(B0:BL2) ; also sheet 3,5,8,10,11
LEFT_SHIFT: AB05.AF2(B0:AF2) ; also sheet 4,7,8,10,11
MA_ENABLE(0-4): AB05.BP1(B0:BP1) AB06.BR2(B1:BR2) ; also sheet 3,8
MA_ENABLE(5-11): AB05.BR2(B1:BR2) ; also sheet 3,10,11
MEM03: AB06.BV2(B1:BV2) ; also sheet 16,23
MEM04: AB05.BR1(B0:BR1) ; also sheet 16,23
MEM05: AB05.BV2(B1:BV2) ; also sheet 16,23
MEM_ENABLE(0-4): AB05.BU2(B0:BU2) AB06.BV1(B1:BV1) ; also sheet 3,4,8
MEM_ENABLE(5-11): AB05.BV1(B1:BV1) ; also sheet 3,10,11
NO_SHIFT: AB05.AE1(B0:AE1) ; also sheet 4,7,8,10,11
PC_ENABLE: AB05.BS2(B0:BS2) ; also sheet 3,8,10,11
RIGHT_SHIFT: AB05.AD2(B0:AD2) ; also sheet 4,7,8,10,11
SR03: A01.D2 AB06.BD2(B1:BD2)
SR04: A01.D1 AB05.BE1(B0:BE1)
SR05: AB05.BD2(B1:BD2) C01.L2
SR_ENABLE: AB05.BC1(B0:BC1) ; also sheet 3,8,10,11

### Notes on the sheet
- Major Register Gating (Sheet 2)
- D-BS-8L-0-9

## Sheet 10 of 23
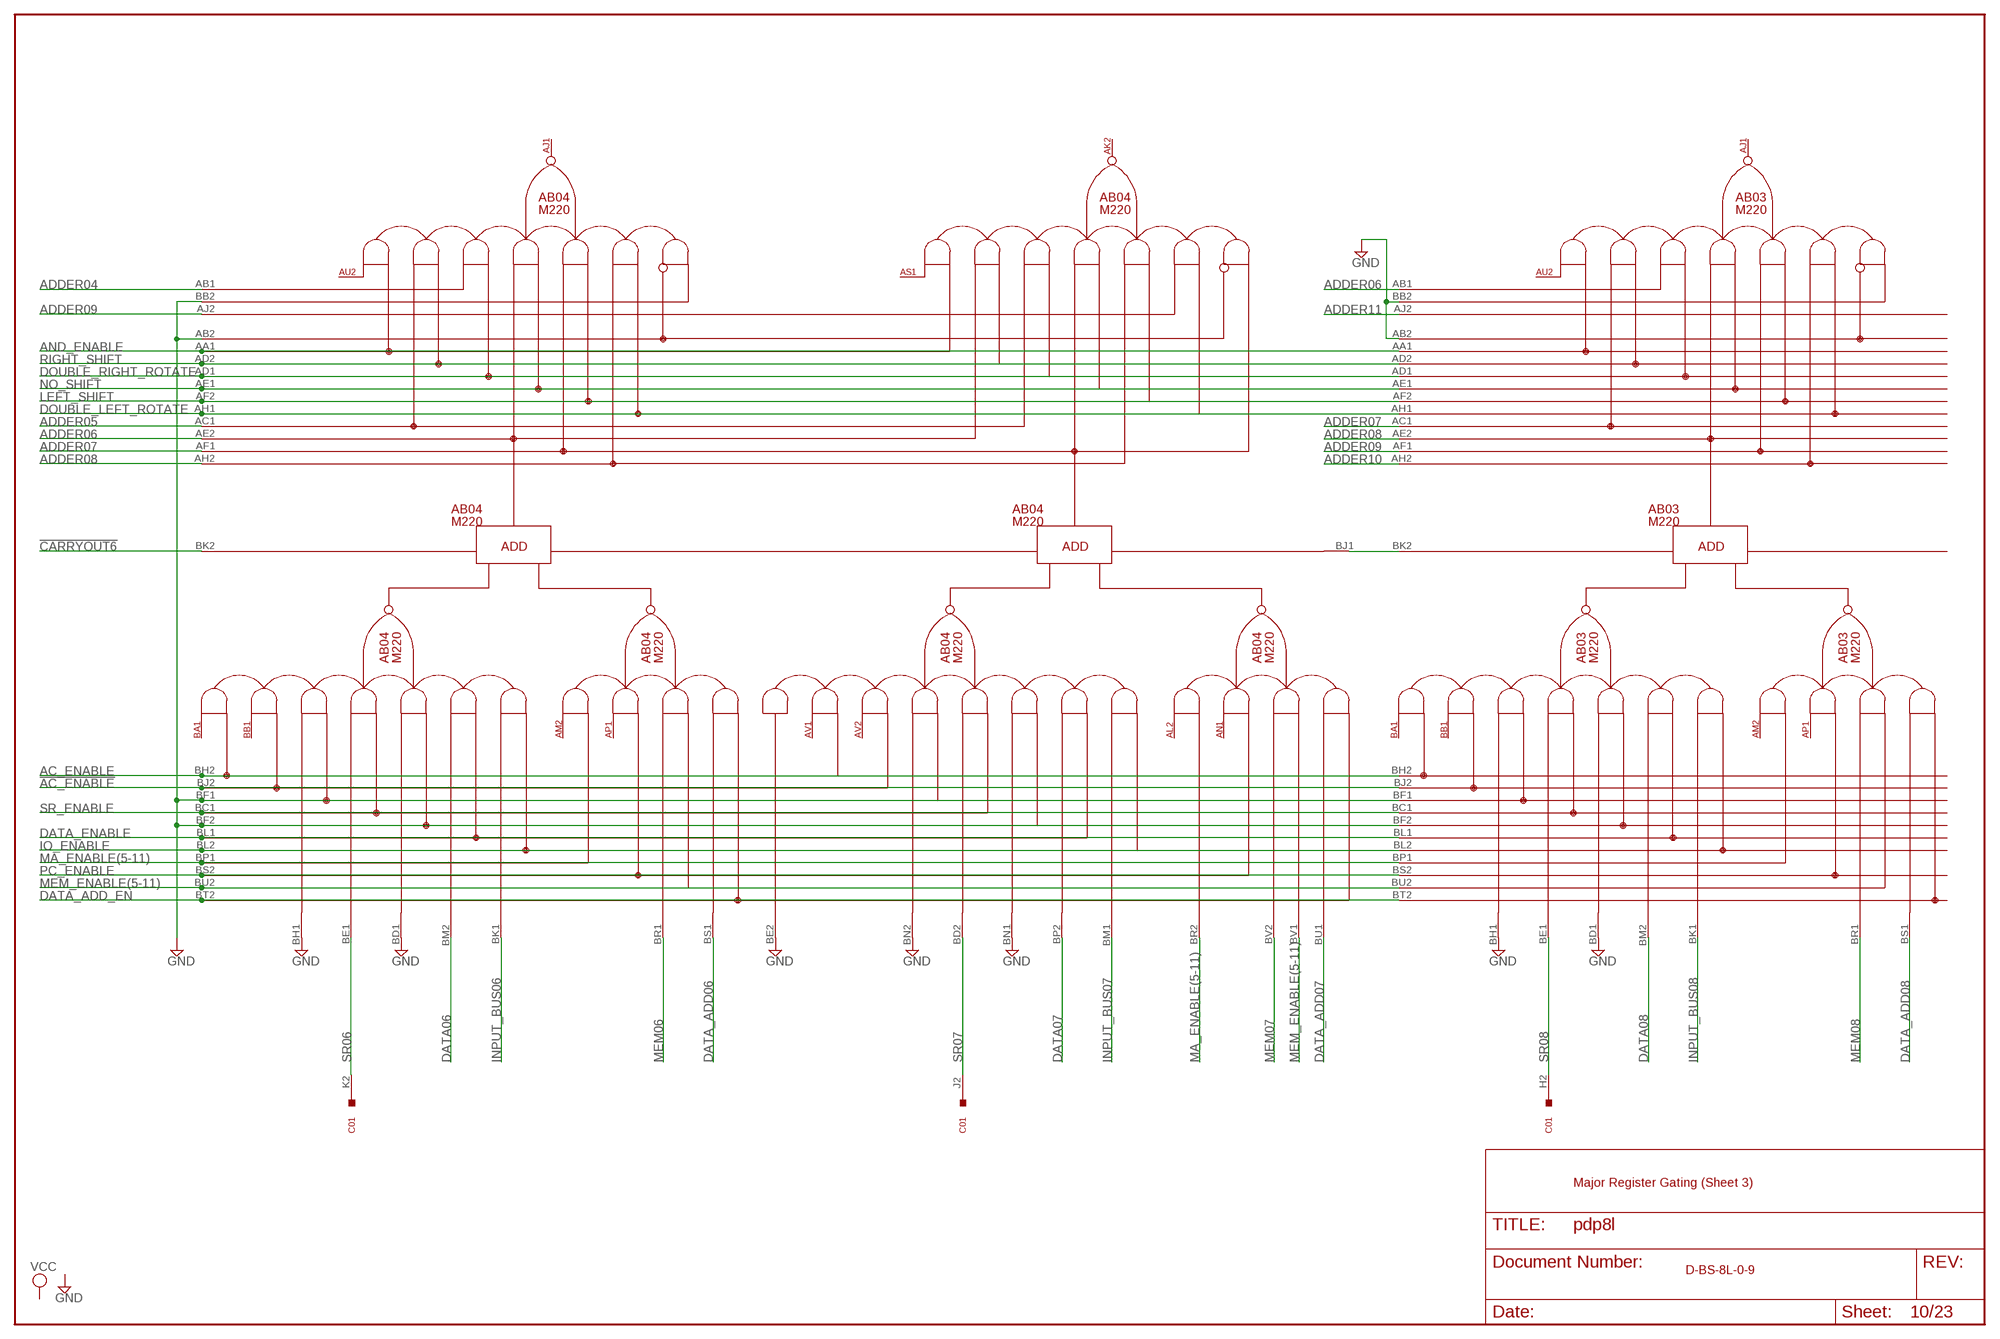
[diagram p9: schematic, sheet 10]

### Nets
!AC_ENABLE: AB03.BJ2(B0:BJ2) AB04.BJ2(B0:BJ2) ; also sheet 3,8,9,11
!CARRYOUT6: AB04.BK2(B0:BK2) ; also sheet 9
!CARRYOUT8: AB03.BK2(B0:BK2) AB04.BJ1(B1:BJ1)
AC_ENABLE: AB03.BH2(B0:BH2) AB04.BH2(B0:BH2) ; also sheet 3,8,9,11
ADDER04: AB04.AB1(B0:AB1) ; also sheet 8,9
ADDER05: AB04.AC1(B0:AC1) ; also sheet 8,9
ADDER06: AB03.AB1(B0:AB1) AB04.AE2(B0:AE2) ; also sheet 9
ADDER07: AB03.AC1(B0:AC1) AB04.AF1(B0:AF1) ; also sheet 9
ADDER08: AB03.AE2(B0:AE2) AB04.AH2(B0:AH2) ; also sheet 11
ADDER09: AB03.AF1(B0:AF1) AB04.AJ2(B0:AJ2) ; also sheet 11
ADDER10: AB03.AH2(B0:AH2) ; also sheet 7,11
ADDER11: AB03.AJ2(B0:AJ2) ; also sheet 7,8,11
AND_ENABLE: AB03.AA1(B0:AA1) AB04.AA1(B0:AA1) ; also sheet 4,8,9,11
DATA06: AB04.BM2(B0:BM2) ; also sheet 12
DATA07: AB04.BP2(B1:BP2) ; also sheet 12
DATA08: AB03.BM2(B0:BM2) ; also sheet 12
DATA_ADD06: AB04.BS1(B0:BS1) ; also sheet 12
DATA_ADD07: AB04.BU1(B1:BU1) ; also sheet 12
DATA_ADD08: AB03.BS1(B0:BS1) ; also sheet 12
DATA_ADD_EN: AB03.BT2(B0:BT2) AB04.BT2(B0:BT2) ; also sheet 3,8,9,11
DATA_ENABLE: AB03.BL1(B0:BL1) AB04.BL1(B0:BL1) ; also sheet 3,8,9,11
DOUBLE_LEFT_ROTATE: AB03.AH1(B0:AH1) AB04.AH1(B0:AH1) ; also sheet 4,7,8,9,11
DOUBLE_RIGHT_ROTATE: AB03.AD1(B0:AD1) AB04.AD1(B0:AD1) ; also sheet 4,7,8,9,11
GND [Supply]: AB03.AB2(B0:AB2) AB03.BB2(B0:BB2) AB03.BD1(B0:BD1) AB03.BF1(B0:BF1) AB03.BF2(B0:BF2) AB03.BH1(B0:BH1) AB04.AB2(B0:AB2) AB04.BB2(B0:BB2) AB04.BD1(B0:BD1) AB04.BE2(B1:BE2) AB04.BF1(B0:BF1) AB04.BF2(B0:BF2) AB04.BH1(B0:BH1) AB04.BN1(B1:BN1) AB04.BN2(B1:BN2) ; also sheet 1,3,8,9,11,12,13,14,15,16,19,20,21,23
INPUT_BUS06: AB04.BK1(B0:BK1) ; also sheet 12
INPUT_BUS07: AB04.BM1(B1:BM1) ; also sheet 12
INPUT_BUS08: AB03.BK1(B0:BK1) ; also sheet 12
IO_ENABLE: AB03.BL2(B0:BL2) AB04.BL2(B0:BL2) ; also sheet 3,5,8,9,11
LEFT_SHIFT: AB03.AF2(B0:AF2) AB04.AF2(B0:AF2) ; also sheet 4,7,8,9,11
MA_ENABLE(5-11): AB03.BP1(B0:BP1) AB04.BP1(B0:BP1) AB04.BR2(B1:BR2) ; also sheet 3,9,11
MEM06: AB04.BR1(B0:BR1) ; also sheet 16,23
MEM07: AB04.BV2(B1:BV2) ; also sheet 16,23
MEM08: AB03.BR1(B0:BR1) ; also sheet 16,23
MEM_ENABLE(5-11): AB03.BU2(B0:BU2) AB04.BU2(B0:BU2) AB04.BV1(B1:BV1) ; also sheet 3,9,11
NO_SHIFT: AB03.AE1(B0:AE1) AB04.AE1(B0:AE1) ; also sheet 4,7,8,9,11
PC_ENABLE: AB03.BS2(B0:BS2) AB04.BS2(B0:BS2) ; also sheet 3,8,9,11
RIGHT_SHIFT: AB03.AD2(B0:AD2) AB04.AD2(B0:AD2) ; also sheet 4,7,8,9,11
SR06: AB04.BE1(B0:BE1) C01.K2
SR07: AB04.BD2(B1:BD2) C01.J2
SR08: AB03.BE1(B0:BE1) C01.H2
SR_ENABLE: AB03.BC1(B0:BC1) AB04.BC1(B0:BC1) ; also sheet 3,8,9,11

### Notes on the sheet
- Major Register Gating (Sheet 3)
- D-BS-8L-0-9

## Sheet 11 of 23
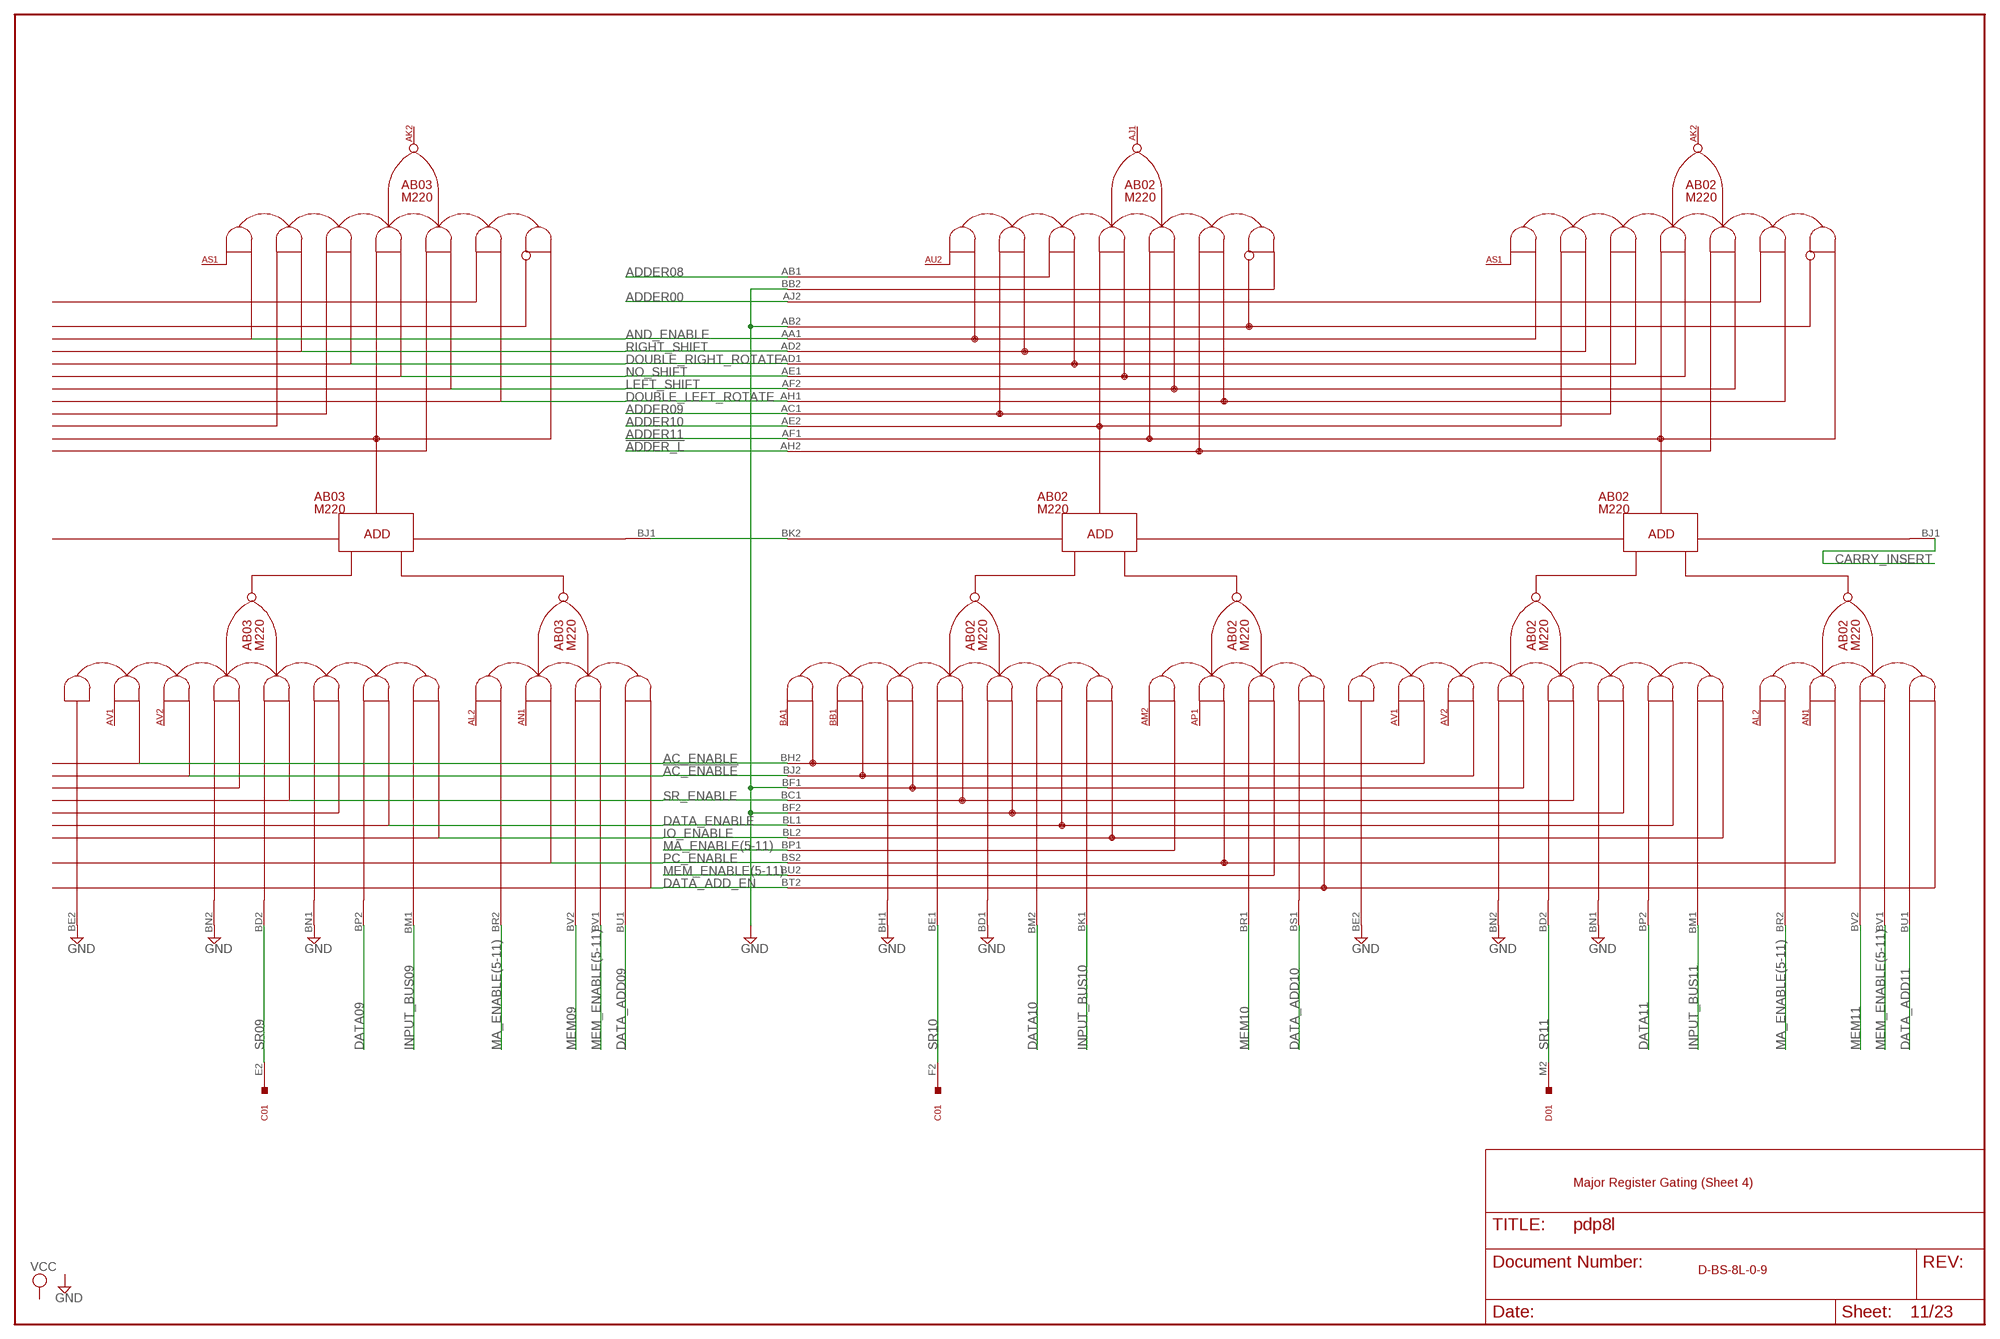
[diagram p10: schematic, sheet 11]

### Nets
!AC_ENABLE: AB02.BJ2(B0:BJ2) ; also sheet 3,8,9,10
!ADDER_L: AB02.AH2(B0:AH2) ; also sheet 7,8
!CARRYOUT10: AB02.BK2(B0:BK2) AB03.BJ1(B1:BJ1)
AC_ENABLE: AB02.BH2(B0:BH2) ; also sheet 3,8,9,10
ADDER00: AB02.AJ2(B0:AJ2) ; also sheet 7,8
ADDER08: AB02.AB1(B0:AB1) ; also sheet 10
ADDER09: AB02.AC1(B0:AC1) ; also sheet 10
ADDER10: AB02.AE2(B0:AE2) ; also sheet 7,10
ADDER11: AB02.AF1(B0:AF1) ; also sheet 7,8,10
AND_ENABLE: AB02.AA1(B0:AA1) ; also sheet 4,8,9,10
CARRY_INSERT: AB02.BJ1(B1:BJ1) ; also sheet 4
DATA09: AB03.BP2(B1:BP2) ; also sheet 12
DATA10: AB02.BM2(B0:BM2) ; also sheet 12
DATA11: AB02.BP2(B1:BP2) ; also sheet 12
DATA_ADD09: AB03.BU1(B1:BU1) ; also sheet 12
DATA_ADD10: AB02.BS1(B0:BS1) ; also sheet 12
DATA_ADD11: AB02.BU1(B1:BU1) ; also sheet 12
DATA_ADD_EN: AB02.BT2(B0:BT2) ; also sheet 3,8,9,10
DATA_ENABLE: AB02.BL1(B0:BL1) ; also sheet 3,8,9,10
DOUBLE_LEFT_ROTATE: AB02.AH1(B0:AH1) ; also sheet 4,7,8,9,10
DOUBLE_RIGHT_ROTATE: AB02.AD1(B0:AD1) ; also sheet 4,7,8,9,10
GND [Supply]: AB02.AB2(B0:AB2) AB02.BB2(B0:BB2) AB02.BD1(B0:BD1) AB02.BE2(B1:BE2) AB02.BF1(B0:BF1) AB02.BF2(B0:BF2) AB02.BH1(B0:BH1) AB02.BN1(B1:BN1) AB02.BN2(B1:BN2) AB03.BE2(B1:BE2) AB03.BN1(B1:BN1) AB03.BN2(B1:BN2) ; also sheet 1,3,8,9,10,12,13,14,15,16,19,20,21,23
INPUT_BUS09: AB03.BM1(B1:BM1) ; also sheet 12
INPUT_BUS10: AB02.BK1(B0:BK1) ; also sheet 12
INPUT_BUS11: AB02.BM1(B1:BM1) ; also sheet 12
IO_ENABLE: AB02.BL2(B0:BL2) ; also sheet 3,5,8,9,10
LEFT_SHIFT: AB02.AF2(B0:AF2) ; also sheet 4,7,8,9,10
MA_ENABLE(5-11): AB02.BP1(B0:BP1) AB02.BR2(B1:BR2) AB03.BR2(B1:BR2) ; also sheet 3,9,10
MEM09: AB03.BV2(B1:BV2) ; also sheet 16,23
MEM10: AB02.BR1(B0:BR1) ; also sheet 16,23
MEM11: AB02.BV2(B1:BV2) ; also sheet 16,23
MEM_ENABLE(5-11): AB02.BU2(B0:BU2) AB02.BV1(B1:BV1) AB03.BV1(B1:BV1) ; also sheet 3,9,10
NO_SHIFT: AB02.AE1(B0:AE1) ; also sheet 4,7,8,9,10
PC_ENABLE: AB02.BS2(B0:BS2) ; also sheet 3,8,9,10
RIGHT_SHIFT: AB02.AD2(B0:AD2) ; also sheet 4,7,8,9,10
SR09: AB03.BD2(B1:BD2) C01.E2
SR10: AB02.BE1(B0:BE1) C01.F2
SR11: AB02.BD2(B1:BD2) D01.M2
SR_ENABLE: AB02.BC1(B0:BC1) ; also sheet 3,8,9,10

### Notes on the sheet
- Major Register Gating (Sheet 4)
- D-BS-8L-0-9